# EAGLE board ZORRO-LAN-IDE-CP-V2E (EAGLE 6.5.0), part 1 of 2
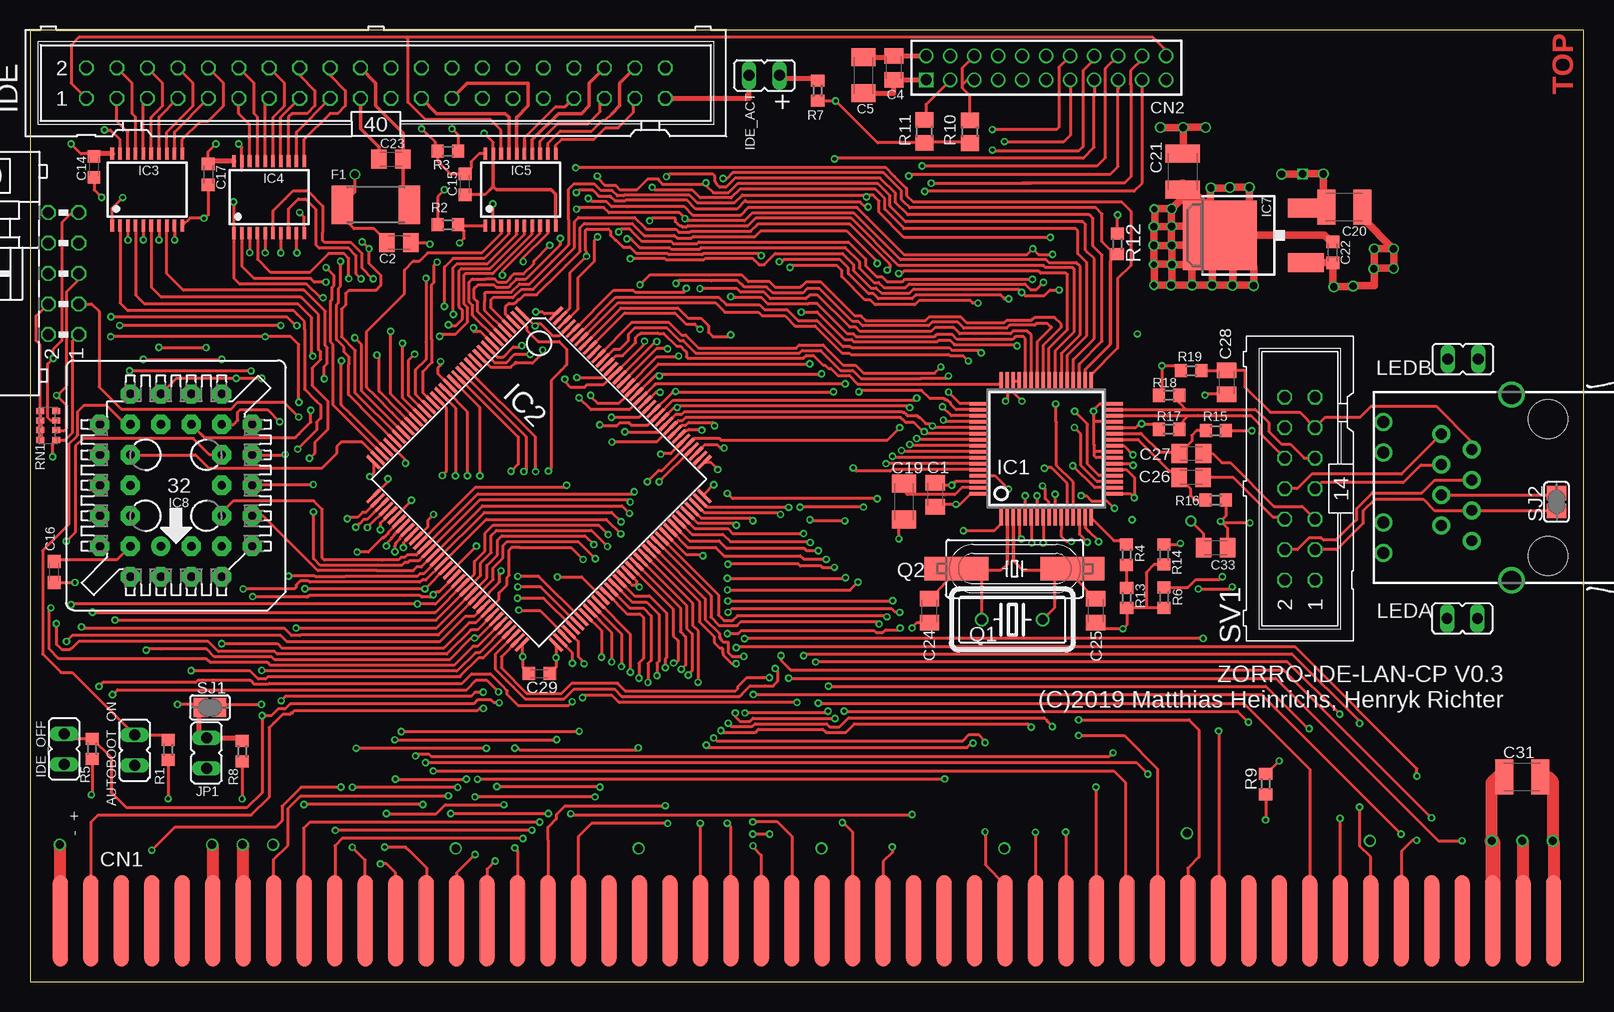
[diagram p3: board, top side]
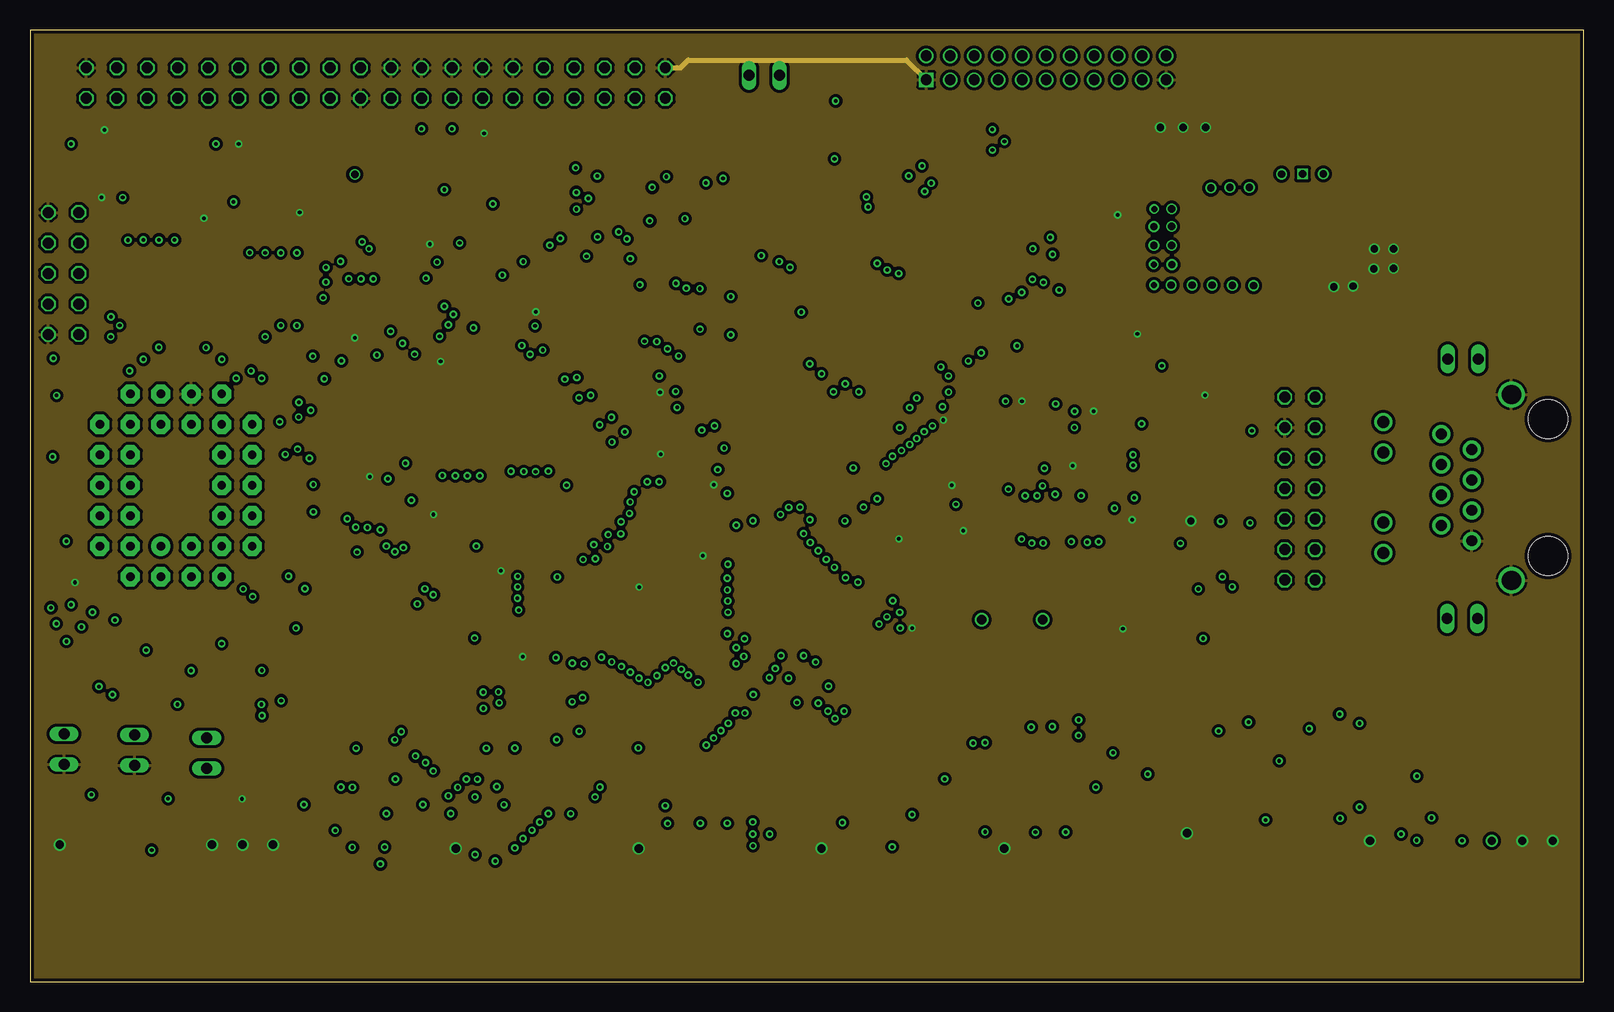
[diagram p4: board, inner layer Route2-GND]
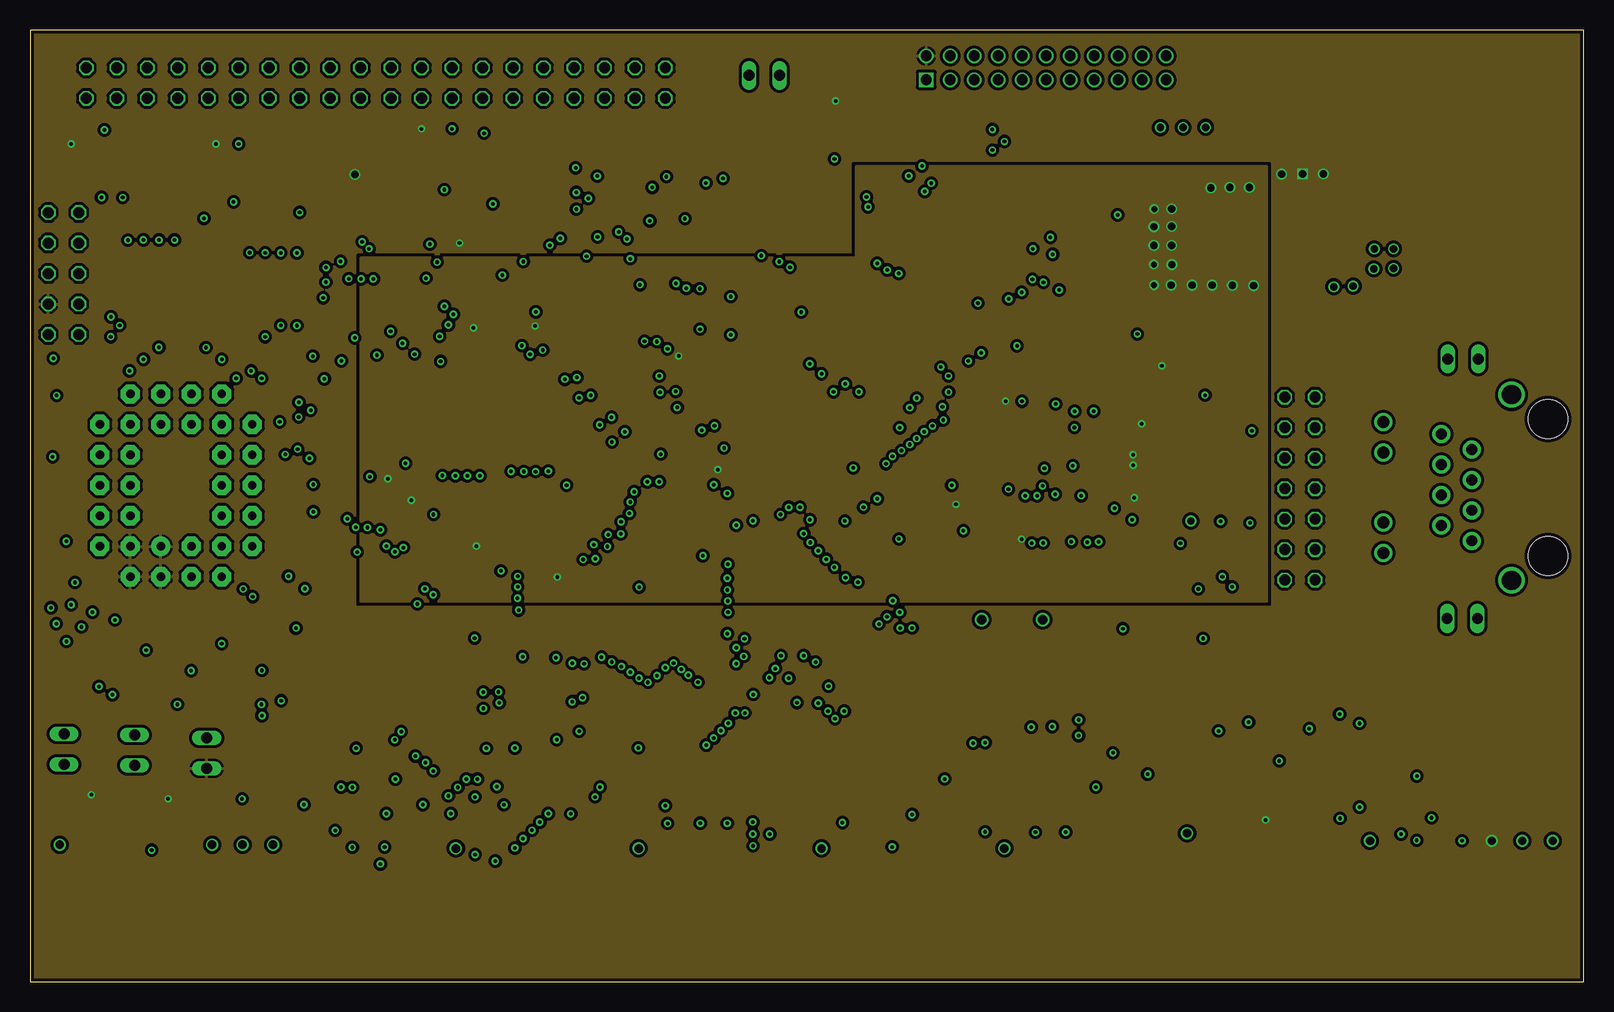
[diagram p5: board, inner layer Route15-VCC]
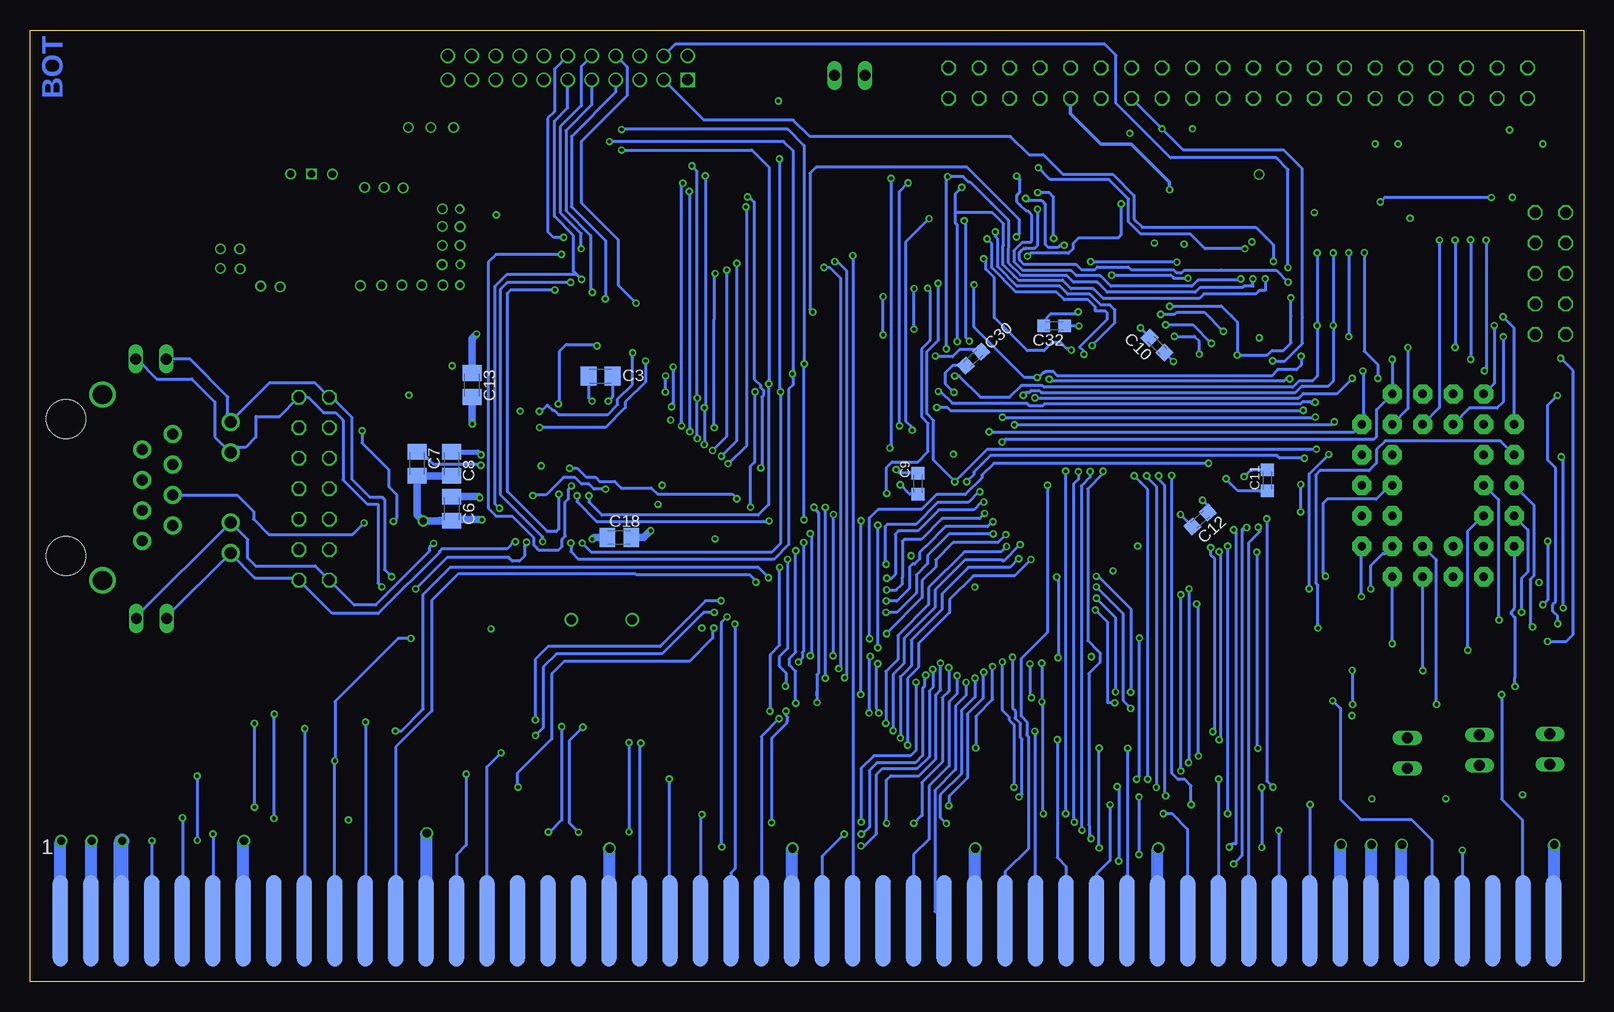
[diagram p6: board, bottom side, seen from below]

Size 129.54 x 79.36 mm. Coordinates in mm from the lower left corner, seen from the top.
Outline: 129.54,0 129.54,79.36 0,79.36 0,0 129.54,0
Copper layers (1+2*15+16): Top 0.035mm / dielectric 0.36mm / Route2-GND 0.035mm / dielectric 0.71mm / Route15-VCC 0.035mm / dielectric 0.36mm / Bottom 0.035mm
Design rules "LeitOn - Standard-Eagle-DRU - 4-Lagen Multilayer - deutsch - Rev 2.0 *": minimum track width 0.15mm, minimum drill 0.3mm, track to track 0.15mm, track to pad 0.15mm, pad to pad 0.15mm, via to via 0.15mm, smd to smd 0.15mm, copper to edge 0.3mm, drill to drill 0.3mm, minimum pad ring 0.15mm, minimum via ring 0.15mm, stop-mask expansion 0.075mm, vias tented up to drill 0.4mm, thermal gap 0.2mm
Net classes: 0 default: width 0.152 mm, drill 0.3 mm; 1 Power: width 0.305 mm, drill 0.3 mm, clearance 0.102 mm

## Footprints (pad centres in the part's own frame; a part is rotated, then mirrored left to right if it is on the bottom)
JP1 = drill 0.914 long: 1 0,-1.27; 2 0,1.27
C0805K = smd 1.3 x 1.6: 1 -1,0; 2 1,0
C1206K = smd 1.5 x 2: 1 -1.5,0; 2 1.5,0
C0603K = smd 1.05 x 1.08: 1 -0.875,0; 2 0.875,0
C1210K = smd 1.5 x 2.9: 1 -1.5,0; 2 1.5,0
LKONT_50_R = smd 1.27 x 7.62 bottom: 1 64.77,0; 3 62.23,0; 5 59.69,0; 7 57.15,0; 9 54.61,0; 11 52.07,0; 13 49.53,0; 15 46.99,0; 17 44.45,0; 19 41.91,0; 21 39.37,0; 23 36.83,0; 25 34.29,0; 27 31.75,0; 29 29.21,0; 31 26.67,0; 33 24.13,0; 35 21.59,0; 37 19.05,0; 39 16.51,0; 41 13.97,0; 43 11.43,0; 45 8.89,0; 47 6.35,0; 49 3.81,0; 51 1.27,0; 53 -1.27,0; 55 -3.81,0; 57 -6.35,0; 59 -8.89,0; 61 -11.43,0; 63 -13.97,0; 65 -16.51,0; 67 -19.05,0; 69 -21.59,0; 71 -24.13,0; 73 -26.67,0; 75 -29.21,0; 77 -31.75,0; 79 -34.29,0; 81 -36.83,0; 83 -39.37,0; 85 -41.91,0; 87 -44.45,0; 89 -46.99,0; 91 -49.53,0; 93 -52.07,0; 95 -54.61,0; 97 -57.15,0; 99 -59.69,0 | smd 1.27 x 7.62: 2 64.77,0; 4 62.23,0; 6 59.69,0; 8 57.15,0; 10 54.61,0; 12 52.07,0; 14 49.53,0; 16 46.99,0; 18 44.45,0; 20 41.91,0; 22 39.37,0; 24 36.83,0; 26 34.29,0; 28 31.75,0; 30 29.21,0; 32 26.67,0; 34 24.13,0; 36 21.59,0; 38 19.05,0; 40 16.51,0; 42 13.97,0; 44 11.43,0; 46 8.89,0; 48 6.35,0; 50 3.81,0; 52 1.27,0; 54 -1.27,0; 56 -3.81,0; 58 -6.35,0; 60 -8.89,0; 62 -11.43,0; 64 -13.97,0; 66 -16.51,0; 68 -19.05,0; 70 -21.59,0; 72 -24.13,0; 74 -26.67,0; 76 -29.21,0; 78 -31.75,0; 80 -34.29,0; 82 -36.83,0; 84 -39.37,0; 86 -41.91,0; 88 -44.45,0; 90 -46.99,0; 92 -49.53,0; 94 -52.07,0; 96 -54.61,0; 98 -57.15,0; 100 -59.69,0
CP-2X11-2.00 = drill 0.914 square: 19 -10,-1 | drill 0.914: 20 -10,1; 21 -8,-1; 22 -8,1; 23 -6,-1; 24 -6,1; 25 -4,-1; 26 -4,1; 27 -2,-1; 28 -2,1; 29 0,-1; 30 0,1; 31 2,-1; 32 2,1; 33 4,-1; 34 4,1; 35 6,-1; 36 6,1; 37 8,-1; 38 8,1; 39 10,-1; 40 10,1
R2512 = smd 1.8 x 3.2: 1 -2.8,0; 2 2.8,0
SQFP-S-10X10-64 = smd 0.3 x 1.6: 1 -3.75,-5.6; 2 -3.25,-5.6; 3 -2.75,-5.6; 4 -2.25,-5.6; 5 -1.75,-5.6; 6 -1.25,-5.6; 7 -0.75,-5.6; 8 -0.25,-5.6; 9 0.25,-5.6; 10 0.75,-5.6; 11 1.25,-5.6; 12 1.75,-5.6; 13 2.25,-5.6; 14 2.75,-5.6; 15 3.25,-5.6; 16 3.75,-5.6; 33 3.75,5.6; 34 3.25,5.6; 35 2.75,5.6; 36 2.25,5.6; 37 1.75,5.6; 38 1.25,5.6; 39 0.75,5.6; 40 0.25,5.6; 41 -0.25,5.6; 42 -0.75,5.6; 43 -1.25,5.6; 44 -1.75,5.6; 45 -2.25,5.6; 46 -2.75,5.6; 47 -3.25,5.6; 48 -3.75,5.6 | smd 1.6 x 0.3: 17 5.6,-3.75; 18 5.6,-3.25; 19 5.6,-2.75; 20 5.6,-2.25; 21 5.6,-1.75; 22 5.6,-1.25; 23 5.6,-0.75; 24 5.6,-0.25; 25 5.6,0.25; 26 5.6,0.75; 27 5.6,1.25; 28 5.6,1.75; 29 5.6,2.25; 30 5.6,2.75; 31 5.6,3.25; 32 5.6,3.75; 49 -5.6,3.75; 50 -5.6,3.25; 51 -5.6,2.75; 52 -5.6,2.25; 53 -5.6,1.75; 54 -5.6,1.25; 55 -5.6,0.75; 56 -5.6,0.25; 57 -5.6,-0.25; 58 -5.6,-0.75; 59 -5.6,-1.25; 60 -5.6,-1.75; 61 -5.6,-2.25; 62 -5.6,-2.75; 63 -5.6,-3.25; 64 -5.6,-3.75
TQFP144 = smd 0.27 x 1.5: 1 -8.75,-10.75; 2 -8.25,-10.75; 3 -7.75,-10.75; 4 -7.25,-10.75; 5 -6.75,-10.75; 6 -6.25,-10.75; 7 -5.75,-10.75; 8 -5.25,-10.75; 9 -4.75,-10.75; 10 -4.25,-10.75; 11 -3.75,-10.75; 12 -3.25,-10.75; 13 -2.75,-10.75; 14 -2.25,-10.75; 15 -1.75,-10.75; 16 -1.25,-10.75; 17 -0.75,-10.75; 18 -0.25,-10.75; 19 0.25,-10.75; 20 0.75,-10.75; 21 1.25,-10.75; 22 1.75,-10.75; 23 2.25,-10.75; 24 2.75,-10.75; 25 3.25,-10.75; 26 3.75,-10.75; 27 4.25,-10.75; 28 4.75,-10.75; 29 5.25,-10.75; 30 5.75,-10.75; 31 6.25,-10.75; 32 6.75,-10.75; 33 7.25,-10.75; 34 7.75,-10.75; 35 8.25,-10.75; 36 8.75,-10.75; 73 8.75,10.75; 74 8.25,10.75; 75 7.75,10.75; 76 7.25,10.75; 77 6.75,10.75; 78 6.25,10.75; 79 5.75,10.75; 80 5.25,10.75; 81 4.75,10.75; 82 4.25,10.75; 83 3.75,10.75; 84 3.25,10.75; 85 2.75,10.75; 86 2.25,10.75; 87 1.75,10.75; 88 1.25,10.75; 89 0.75,10.75; 90 0.25,10.75; 91 -0.25,10.75; 92 -0.75,10.75; 93 -1.25,10.75; 94 -1.75,10.75; 95 -2.25,10.75; 96 -2.75,10.75; 97 -3.25,10.75; 98 -3.75,10.75; 99 -4.25,10.75; 100 -4.75,10.75; 101 -5.25,10.75; 102 -5.75,10.75; 103 -6.25,10.75; 104 -6.75,10.75; 105 -7.25,10.75; 106 -7.75,10.75; 107 -8.25,10.75; 108 -8.75,10.75 | smd 1.5 x 0.27: 37 10.75,-8.75; 38 10.75,-8.25; 39 10.75,-7.75; 40 10.75,-7.25; 41 10.75,-6.75; 42 10.75,-6.25; 43 10.75,-5.75; 44 10.75,-5.25; 45 10.75,-4.75; 46 10.75,-4.25; 47 10.75,-3.75; 48 10.75,-3.25; 49 10.75,-2.75; 50 10.75,-2.25; 51 10.75,-1.75; 52 10.75,-1.25; 53 10.75,-0.75; 54 10.75,-0.25; 55 10.75,0.25; 56 10.75,0.75; 57 10.75,1.25; 58 10.75,1.75; 59 10.75,2.25; 60 10.75,2.75; 61 10.75,3.25; 62 10.75,3.75; 63 10.75,4.25; 64 10.75,4.75; 65 10.75,5.25; 66 10.75,5.75; 67 10.75,6.25; 68 10.75,6.75; 69 10.75,7.25; 70 10.75,7.75; 71 10.75,8.25; 72 10.75,8.75; 109 -10.75,8.75; 110 -10.75,8.25; 111 -10.75,7.75; 112 -10.75,7.25; 113 -10.75,6.75; 114 -10.75,6.25; 115 -10.75,5.75; 116 -10.75,5.25; 117 -10.75,4.75; 118 -10.75,4.25; 119 -10.75,3.75; 120 -10.75,3.25; 121 -10.75,2.75; 122 -10.75,2.25; 123 -10.75,1.75; 124 -10.75,1.25; 125 -10.75,0.75; 126 -10.75,0.25; 127 -10.75,-0.25; 128 -10.75,-0.75; 129 -10.75,-1.25; 130 -10.75,-1.75; 131 -10.75,-2.25; 132 -10.75,-2.75; 133 -10.75,-3.25; 134 -10.75,-3.75; 135 -10.75,-4.25; 136 -10.75,-4.75; 137 -10.75,-5.25; 138 -10.75,-5.75; 139 -10.75,-6.25; 140 -10.75,-6.75; 141 -10.75,-7.25; 142 -10.75,-7.75; 143 -10.75,-8.25; 144 -10.75,-8.75
TSSOP20 = smd 0.3 x 1: 1 -2.925,-3; 2 -2.275,-3; 3 -1.625,-3; 4 -0.975,-3; 5 -0.325,-3; 6 0.325,-3; 7 0.975,-3; 8 1.625,-3; 9 2.275,-3; 10 2.925,-3; 11 2.925,3; 12 2.275,3; 13 1.625,3; 14 0.975,3; 15 0.325,3; 16 -0.325,3; 17 -0.975,3; 18 -1.625,3; 19 -2.275,3; 20 -2.925,3
DPACK = smd 1.6 x 3: 1 -2.28,-4.8; 3 2.28,-4.8 | smd 5.8 x 6.2: 4 0,2.38
PLCC-SR32 = drill 0.7 pad 1.6: 1 1.27,5.08 | drill 0.7 pad 1.6 octagon: 2 -1.27,7.62; 3 -1.27,5.08; 4 -3.81,7.62; 5 -6.35,5.08; 6 -3.81,5.08; 7 -6.35,2.54; 8 -3.81,2.54; 9 -6.35,0; 10 -3.81,0; 11 -6.35,-2.54; 12 -3.81,-2.54; 13 -6.35,-5.08; 14 -3.81,-7.62; 15 -3.81,-5.08; 16 -1.27,-7.62; 17 -1.27,-5.08; 18 1.27,-7.62; 19 1.27,-5.08; 20 3.81,-7.62; 21 6.35,-5.08; 22 3.81,-5.08; 23 6.35,-2.54; 24 3.81,-2.54; 25 6.35,0; 26 3.81,0; 27 6.35,2.54; 28 3.81,2.54; 29 6.35,5.08; 30 3.81,7.62; 31 3.81,5.08; 32 1.27,7.62
ML40 = drill 0.914 octagon: 1 -24.13,-1.27; 2 -24.13,1.27; 3 -21.59,-1.27; 4 -21.59,1.27; 5 -19.05,-1.27; 6 -19.05,1.27; 7 -16.51,-1.27; 8 -16.51,1.27; 9 -13.97,-1.27; 10 -13.97,1.27; 11 -11.43,-1.27; 12 -11.43,1.27; 13 -8.89,-1.27; 14 -8.89,1.27; 15 -6.35,-1.27; 16 -6.35,1.27; 17 -3.81,-1.27; 18 -3.81,1.27; 19 -1.27,-1.27; 20 -1.27,1.27; 21 1.27,-1.27; 22 1.27,1.27; 23 3.81,-1.27; 24 3.81,1.27; 25 6.35,-1.27; 26 6.35,1.27; 27 8.89,-1.27; 28 8.89,1.27; 29 11.43,-1.27; 30 11.43,1.27; 31 13.97,-1.27; 32 13.97,1.27; 33 16.51,-1.27; 34 16.51,1.27; 35 19.05,-1.27; 36 19.05,1.27; 37 21.59,-1.27; 38 21.59,1.27; 39 24.13,-1.27; 40 24.13,1.27
HC18U-V = drill 0.813: 1 -2.54,0; 2 2.54,0
HC49UP = smd 5.334 x 1.93: 1 -4.826,0; 2 4.826,0
R0603 = smd 1 x 1.1: 1 -0.85,0; 2 0.85,0
R0805 = smd 1.3 x 1.5: 1 -0.95,0; 2 0.95,0
CAY16 = smd 0.5 x 0.65: 1 -1.2,-0.675; 2 -0.4,-0.675; 3 0.4,-0.675; 4 1.2,-0.675; 5 1.2,0.675; 6 0.4,0.675; 7 -0.4,0.675; 8 -1.2,0.675
SJ = smd 1.168 x 1.6: 1 -0.762,0; 2 0.762,0
ML14 = drill 0.914 octagon: 1 -7.62,-1.27; 2 -7.62,1.27; 3 -5.08,-1.27; 4 -5.08,1.27; 5 -2.54,-1.27; 6 -2.54,1.27; 7 0,-1.27; 8 0,1.27; 9 2.54,-1.27; 10 2.54,1.27; 11 5.08,-1.27; 12 5.08,1.27; 13 7.62,-1.27; 14 7.62,1.27
ML10L = drill 0.914 octagon: 1 -5.08,-1.27; 2 -5.08,1.27; 3 -2.54,-1.27; 4 -2.54,1.27; 5 0,-1.27; 6 0,1.27; 7 2.54,-1.27; 8 2.54,1.27; 9 5.08,-1.27; 10 5.08,1.27
SI-50170 = drill 0.9 pad 1.5: 1 4.445,5.842; 2 3.175,3.302; 3 1.905,5.842; 4 0.635,3.302; 5 -0.635,5.842; 6 -1.905,3.302; 7 -3.175,5.842; 8 -4.445,3.302 | drill 1.016 pad 1.5: A1 -5.461,10.668; A2 2.921,10.668; C1 -2.921,10.668; C2 5.461,10.668 | drill 1.6 pad 2.2: S1 -7.747,0; S2 7.747,0 | hole 3.251: -5.715,-3.048; 5.715,-3.048

## Placement (x,y rotation side)
AUTOBOOT_ON  [JP1]  8.72,19.31 0 top
C1  100nF  [C0805K]  75.47,40.62 270 top
C2  10u  [C0805K]  30.77,61.62 0 top
C3  100nF  [C0805K]  81.98,50.49 0 bottom
C4  100nF  [C0805K]  72.01,76.2 90 top
C5  47uF  [C1206K]  69.47,75.56 270 top
C6  100nF  [C0805K]  94.39,39.44 90 bottom
C7  100nF  [C0805K]  97.27,43.2 90 bottom
C8  100nF  [C0805K]  94.39,43.19 90 bottom
C9  100n  [C0603K]  55.52,41.53 90 bottom
C10  100n  [C0603K]  35.59,53.07 134.9 bottom
C11  100n  [C0603K]  26.39,41.81 90 bottom
C12  100n  [C0603K]  32,38.54 222.1 bottom
C13  100nF  [C0805K]  92.69,49.75 270 bottom
C14  100n  [C0603K]  5.33,67.94 270 top
C15  100n  [C0603K]  36.26,66.48 270 top
C16  100n  [C0603K]  2.01,34.17 270 top
C17  100n  [C0603K]  14.86,67.31 270 top
C18  100nF  [C0805K]  80.41,37.04 180 bottom
C19  10u  [C1206K]  72.84,40.03 270 top
C20  10u  [C1210K]  109.55,64.58 0 top
C21  10u  [C1210K]  96.08,67.55 90 top
C22  100n  [C0603K]  108.59,60.82 270 top
C23  10u  [C0805K]  30.1,68.58 180 top
C24  27p  [C0805K]  74.97,30.92 270 top
C25  27p  [C0805K]  88.83,30.93 270 top
C26  6.8n  [C0805K]  96.79,42.05 0 top
C27  6.8n  [C0805K]  96.81,44.04 0 top
C28  10n  [C0805K]  99.75,49.99 90 top
C29  100n  [C0603K]  42.45,25.7 180 top
C30  100n  [C0603K]  50.9,51.96 42.4 bottom
C31  47u  [C1210K]  124.38,17.08 0 top
C32  100n  [C0603K]  44.16,54.69 180 bottom
C33  10n  [C0805K]  98.84,36.2 180 top
CN1  ZORROII_EDGE_ROUND_CONTACTS  [LKONT_50_R]  62.23,5.08 0 top
CN2  A1200-CLOCKPORT  [CP-2X11-2.00]  84.71,76.2 0 top
F1  500mA  [R2512]  28.83,64.77 180 top
IC1  ENC624J600  [SQFP-S-10X10-64]  84.71,44.45 0 top
IC2  XC95288XL-TQ144  [TQFP144]  42.43,41.91 225 top
IC3  74HCT245PW  [TSSOP20]  9.78,66.04 0 top
IC4  74HCT245PW  [TSSOP20]  19.94,65.41 0 top
IC5  74HCT245PW  [TSSOP20]  40.89,66.04 0 top
IC7  LD117ADT33TR  [DPACK]  101.57,62.23 90 top
IC8  AM29F010S  [PLCC-SR32]  12.17,41.39 180 top
IDE  [ML40]  28.83,74.93 0 top
IDE_ACT  [JP1]  61.21,75.56 90 top
IDE_OFF  [JP1]  2.84,19.41 0 top
JP1  [JP1]  14.73,19.08 180 top
LEDA  [JP1]  119.4,30.29 270 top
LEDB  [JP1]  119.44,51.93 90 top
Q1  25MHz  [HC18U-V]  81.88,30.19 180 top
Q2  25MHz  [HC49UP]  82.07,34.43 180 top
R1  4.7k  [R0603]  11.52,19.33 90 top
R2  4.7k  [R0603]  34.85,63.12 180 top
R3  4.7k  [R0603]  34.83,69.25 0 top
R4  390  [R0603]  91.4,35.6 270 top
R5  4.7k  [R0603]  5.18,19.42 90 top
R6  180  [R0603]  94.53,32.03 270 top
R7  330  [R0603]  65.66,74.3 90 top
R8  4.7k  [R0603]  17.69,19.22 270 top
R9  4.7k  [R0603]  103,16.47 90 top
R10  1K  [R0805]  78.36,70.87 90 top
R11  1K  [R0805]  74.57,70.89 90 top
R12  3.3k  [R0603]  90.65,61.52 270 top
R13  12k  [R0603]  91.42,32 270 top
R14  180  [R0603]  94.52,35.63 270 top
R15  49.9  [R0603]  98.86,45.96 180 top
R16  49.9  [R0603]  98.85,40.16 180 top
R17  49.9  [R0603]  94.94,46.06 180 top
R18  49.9  [R0603]  94.96,48.9 180 top
R19  10  [R0603]  96.79,50.95 180 top
RN1  [CAY16]  1.52,46.38 90 top
SJ1  [SJ]  15,22.87 180 top
SJ2  [SJ]  127.25,40.01 90 top
SV1  [ML14]  105.85,41.12 90 top
SV2  [ML10L]  2.79,59.05 90 top
X1  SI-50170  [SI-50170]  123.49,41.21 90 top

## Tracks (layer width: path | path; a pad name or v marks a point on that pad's centre or on a via)
!AS  (via drill 0.3)
  Top 0.254: v37.11,10.61 35.56,9.07 CN1.74 | v47.1,15.41 v37.09,15.41 | IC2.80 | IC2.80 47.64,29.27 v47.64,27.06 | v47.64,27.06
  Bottom 0.254: v37.09,15.41 37.11,15.4 v37.11,10.61 | v47.64,27.06 47.64,22.8 47.41,22.58 47.41,22.05 47.4,22.04 47.4,21.95 46.94,21.5 46.96,21.48 46.96,20.35 46.85,20.24 46.85,15.67 v47.1,15.41 46.94,15.57
!BERR  (via drill 0.3)
  Top 0.254: IC2.98 57.38,32.26 57.38,30.57 57.84,30.11 58.57,30.11 58.97,30.51 71.36,30.51 v71.44,30.43 | 71.09,5.12 CN1.46 71.12,10.02 71.88,10.78 v71.88,11.25
  Bottom 0.254: v71.88,11.25 71.88,29.99 v71.44,30.43
!CFIN  (via drill 0.3)
  Top 0.254: IC2.104 | IC2.104 55.65,38.23 58.73,38.23 58.73,38.22 v58.88,38.06 | v115.6,11.8 115.25,11.8 114.32,10.86 114.32,5.09 CN1.12 | v58.88,27.85 58.97,27.94 105.43,27.94 115.61,17.76 v115.61,17.14
  Bottom 0.254: v58.88,38.06 v58.88,27.85 | v115.61,17.14 v115.61,11.81 v115.6,11.8
!CFOUT  (via drill 0.3)
  Top 0.254: IC2.105 55.2,39.44 55.94,38.69 60.02,38.69 v60.26,38.44 | v60.29,23.95 102.63,23.95 114.3,12.29 v114.29,12.3
  Bottom 0.254: 60.25,38.43 v60.26,38.44 60.29,38.42 v60.29,23.95 | CN1.11 | CN1.11 | v114.29,12.3 114.29,5.09 CN1.11
!DS0  (via drill 0.3)
  Top 0.254: IC2.93 54.74,31.37 54.74,29.48 55.2,29.01 55.2,25.93 54.88,25.6 v54.88,25.57 | v60.25,12.32 v61.66,12.32
  Bottom 0.254: v54.88,25.57 54.98,25.46 54.98,24.63 55.14,24.48 55.14,18.86 55.74,18.25 58.94,18.25 59.57,17.62 59.57,12.88 60.14,12.32 v60.25,12.32 | v61.66,12.32 63.5,10.48 CN1.51
!DS1  (via drill 0.3)
  Top 0.254: CN1.98 5.1,5.1 5.1,13.32 5.68,13.91 18.45,13.91 19.92,15.38 19.92,21.18 20.3,21.55 20.32,21.55 21.05,22.29 21.67,22.29 21.83,22.44 21.86,22.41 22.04,22.59 37.29,22.59 37.49,22.79 v37.78,22.79 | IC2.78 42.57,32.93 v40.65,32.93
  Bottom 0.254: v40.65,32.93 38.44,30.71 38.44,23.44 v37.78,22.79
!DTACK  (via drill 0.3)
  Top 0.254: IC2.85 49.76,30.68 50.84,30.68 51.16,30.36 51.16,26.98 50.77,26.58 v50.77,25.31 | v53.15,13.2 46.81,13.2 45.71,12.09 45.71,5.09 CN1.66
  Bottom 0.254: v50.77,25.31 50.77,23.75 51.9,22.61 51.9,17.34 53.67,15.56 53.67,13.68 53.63,13.68 v53.15,13.2
!FCS  (via drill 0.3)
  Top 0.254: IC2.77 42.82,31.97 v40.64,31.97 | 7.08,24.14 v6.88,23.94 7.29,24.35 36.4,24.35 37.16,25.11 38.1,25.11 v39.05,24.16
  Bottom 0.254: CN1.97 5.11,5.11 5.11,13.48 6.86,15.23 6.86,23.92 v6.88,23.94 | v40.64,31.97 40.64,31.95 39.05,30.36 v39.05,24.16
!IDE_ACT
  Top 0.406: IDE.39 59.94,73.66 IDE_ACT.2
!IDE_R
  Top 0.305: IC5.16 40.57,72.08 40.58,72.08 41.53,73.03 41.53,74.93 36.45,74.93 IDE.25
!IDE_W
  Top 0.305: IC5.17 39.92,72.09 39.62,72.39 33.91,72.39 IDE.23
!LDS  (via drill 0.3)
  Top 0.254: v40.42,11.16 40.64,10.94 CN1.70 | IC2.82 49.3,29.02 v49.3,26.28 | v40.41,19.47 40.69,19.47 40.82,19.35 50.56,19.35 v50.71,19.5
  Bottom 0.254: v49.3,26.28 49.3,23.53 50.71,22.12 v50.71,19.5 | v40.42,11.16 40.42,19.46 v40.41,19.47
!MTACK  (via drill 0.3)
  Top 0.254: IC2.96 51.97,36.23 56.28,31.93 56.28,30.21 57.46,29.03 57.46,28.79 57.51,28.75 57.51,28.65 57.61,28.55 57.61,28.5 57.79,28.32 58.18,28.32 58.2,28.3 58.2,27.47 58.54,27.13 v59.5,27.13 | 59.7,22.51 v59.6,22.41 66.37,22.41 v66.52,22.56 | 68.58,8.28 CN1.48 68.57,12.48 67.78,13.28 v67.72,13.28
  Bottom 0.254: v59.5,27.13 59.6,27.04 v59.6,22.41 | v66.52,22.56 66.52,22.21 66.38,22.07 66.38,21.74 66.44,21.67 66.44,21.57 67.72,20.29 v67.72,13.28
!MTCR  (via drill 0.3)
  Top 0.254: IC2.101 53.74,38.01 54.98,36.76 57.44,36.76 58.08,36.13 64.55,36.13 64.75,35.93 65.56,35.93 65.58,35.95 v65.71,35.95 | CN1.18 106.68,17.72 101.17,23.23 v65.71,23.23
  Bottom 0.254: v65.71,23.23 65.71,25.88 66.23,26.4 66.23,26.95 65.71,27.47 v65.71,35.94 v65.71,35.95
!OVR  (via drill 0.3)
  Top 0.254: IC2.100 53.39,37.66 54.81,36.23 57.16,36.23 57.87,35.52 64.2,35.52 64.49,35.24 66.36,35.24 v66.38,35.22 | v106.64,21.11 106.54,21.11 103.01,24.64 v66.57,24.64
  Bottom 0.254: v66.38,35.22 66.38,27.78 67.09,27.07 67.09,26.33 66.5,25.74 66.5,24.75 66.57,24.69 v66.57,24.64 | v106.64,21.11 106.64,5.12 CN1.17
!OWN  (via drill 0.3)
  Top 0.254: IC2.107 56.33,39.68 56.33,39.66 56.44,39.55 v63.25,39.55 | v63.24,25.31 103.85,25.31 117.41,11.75 119.37,11.75 v119.38,11.76
  Bottom 0.254: 119.36,5.1 CN1.7 | v63.24,25.31 v63.24,39.55 v63.25,39.55 | v119.38,11.76 CN1.7 | CN1.7
!RESET  (via drill 0.3)
  Top 0.254: IC2.143 44.23,55.34 44.23,55.39 45,56.17 45,59.11 46.38,60.5 v46.4,60.5 46.4,60.88 46.31,60.97 46.31,62.66 46.42,62.77 48.22,62.77 48.39,62.6 48.39,62.25 48.81,61.83 48.86,61.83 49.35,61.34 49.37,61.34 49.44,61.27 50,61.27 50.54,60.73 53.13,60.73 53.24,60.61 56.03,60.61 56.14,60.73 60.77,60.73 v60.96,60.54 | IC5.2 38.62,64.82 v38.59,64.85
  Bottom 0.254: v38.59,64.85 38.59,62.26 38.83,62.02 42.13,62.02 42.6,61.55 42.6,61.09 42.96,60.73 46.16,60.73 v46.4,60.5 | v60.96,60.54 CN1.53
!SLAVE  (via drill 0.3)
  Top 0.254: IC2.106 55.54,39.79 56.21,39.12 62.45,39.12 62.45,39.07 v62.56,38.96 | v62.61,27.18 v62.62,27.17 62.62,26.79 63.4,26 104.49,26 v116.83,13.66
  Bottom 0.254: v62.61,27.18 62.58,27.21 62.58,38.95 v62.56,38.96 | CN1.9 116.83,5.09 v116.83,13.66
!UDS  (via drill 0.3)
  Top 0.254: 38.05,5.13 CN1.72 38.1,9.39 v38.78,10.07 | IC2.81 47.47,30.15 47.47,30.13 48.49,29.11 v48.49,26.67 v48.49,26.66 | v47.52,16.23 47.47,16.27 v38.91,16.27
  Bottom 0.254: v47.52,16.23 47.52,21.44 47.92,21.84 47.92,22.07 48.49,22.64 v48.49,26.66 | v38.91,16.27 38.78,16.14 v38.78,10.07
+3V3  (via drill 0.3, 0.5, 0.6)
  Top 0.254: IC1.28 92.17,46.2 92.49,46.52 v92.67,46.52 93.63,46.52 R17.2 | IC1.25 91.18,44.7 v91.95,43.93 | IC1.22 91.83,43.2 v91.96,43.07 91.97,43.08 | IC1.21 91.41,42.7 92.05,42.06 v92.05,40.36 91.71,40.7 IC1.17 | IC1.64 79.08,40.67 78.38,40.67 77.51,39.8 v77.19,39.8 75.65,39.8 C1.2 | IC1.4 82.46,37.11 v82.66,36.91 | 28.67,40.5 IC2.37 29.84,41.7 v29.84,41.93 | IC2.1 41.01,55.67 41.11,55.67 v42.1,54.68 | IC2.8 38.54,53.24 37.57,54.2 37.28,54.2 | v42.1,54.68 42.1,54.63 | 37.28,54.2 v36.97,54.52 | 37.28,54.2 37,54.2 | IC2.141 44.9,54.63 44.13,53.85 43.58,53.85 43.53,53.91 | 43.53,53.91 | 43.53,53.91 42.6,54.84 42.26,54.84 v42.1,54.68 | IC2.127 52.27,52.11 54.01,52.11 v54.07,52.17 | IC2.109 56.72,43.32 v57.34,42.7 | IC1.47 81.46,48.55 v81.32,48.41 | IC2.55 35.01,34.13 v37.21,36.33 | IC2.42 30.41,38.75 v31.8,40.14 | IC2.73 v43.84,27.02 | v43.84,27.02 v43.85,27.02 | 47.73,32.03 IC2.84 45.99,33.75 v43.95,33.75 | v43.84,27.02 43.84,26.22 C29.1 | C21.1 96.08,65.96 | 95.19,59.78 v95.19,59.8 | 96.87,58.12 v96.87,58.09 | v98.54,58.09 98.57,58.09 98.57,59.75 | 98.46,66.18 98.46,64.72 97.93,64.19 | R18.2 94.35,49.14 v94.35,51.36 95.53,51.36 R19.2
  Top 0.61: 99.73,61.69 99.55,61.87 | 99.55,61.87 IC7.4 | 95.14,58.1 98.55,58.1 98.57,58.09 100.25,58.09 100.27,58.07 | 100.27,58.07 102,58.07 102.01,58.05 102.01,59.58 101.95,59.64 | 100.27,58.07 100.27,59.71 | 93.68,62.98 v95.17,62.98 95.19,62.99 96.43,62.99 96.44,63.01 | 96.08,65.96 96.08,65.34 95.19,64.45 93.77,64.45 93.76,64.44 93.76,63.04 93.69,62.98 93.69,61.39 | 93.69,61.39 93.69,59.83 93.68,59.82 95.16,59.82 95.17,59.8 | 95.17,59.8 95.17,61.36 95.16,61.37 95.16,62.99 95.14,63.01 95.14,64.45 95.16,64.47 | 95.17,59.8 95.17,58.07 93.76,58.07 93.73,58.1 93.73,59.78 | 93.69,61.39 v95.17,61.39 95.19,61.4 96.36,61.4 96.38,61.42 | 95.19,59.78 96.73,59.78 96.74,59.8 | 96.87,58.12 96.87,59.83 96.84,59.87 | 98.57,58.1 98.57,59.75 98.6,59.78 | C22.1 108.44,61.69 107.89,62.25 99.92,62.25 99.55,61.87 | 98.41,64.98 98.41,66.14 98.46,66.18 100,66.18 100.04,66.23 101.66,66.23 101.66,64.93 101.65,64.91
  Top 1.676: IC7.4 99.19,62.94 97.93,64.19 C21.1
  Bottom 0.254: C3.2 80.98,48.76 v81.32,48.41 | C9.2 57.04,42.4 v57.34,42.7 | C12.1 31.35,39.69 v31.8,40.14 | v43.85,27.02 43.8,27.07 43.8,33.6 v43.95,33.75 | 92.67,48.73 C13.2 | C7.2 96.95,44.2 95.92,43.17 92.06,43.17 v91.96,43.07 | v54.07,52.17 54.01,52.11 52.64,52.11 52.04,52.7 50.45,52.7 50.3,52.55 C30.2 | C32.1 42.11,54.69 v42.1,54.68 | C11.1 28.84,40.94 v29.84,41.93 | C10.2 36.21,53.76 v36.97,54.52
  Bottom 0.406: C8.2 92.2,44.19 v91.95,43.93
  Bottom 0.61: 92.67,48.73 v92.67,46.52 | C6.2 92.13,40.44 v92.05,40.36 | C18.2 82.53,37.04 v82.66,36.91
  other vias: 93.71,64.44 93.69,58.09 93.68,62.96 93.68,61.4 93.68,59.8 95.17,64.44 95.12,58.09 100.23,58.07 102,58.04 98.44,66.18 100.03,66.23 101.65,66.23
  pour Route15-VCC (isolate 0.254): 27.56,31.75 103.12,31.75 103.12,67.94 68.83,67.94 68.83,60.33 27.56,60.33
+5V  (via drill 0.3, 0.3 pad 0.3, 0.6, 0.7)
  Top 0.254: IC3.20 4.24,69.04 v3.43,69.85 | C17.1 14.86,69.22 v15.49,69.85 | v35.81,61.59 36.21,61.99 36.21,62.61 R2.1 35.83,62.99 37.92,62.99 | R7.1 v67.16,73.44 | v67.16,73.44 | IC8.31 7.22,35.17 2.14,35.17 C16.1 | R10.1 78.33,69.92 78.25,70.01 74.63,70.01 R11.1 70.66,69.94 v67.16,73.44 | R5.1 5.18,15.65 v5.12,15.6 | RN1.6 RN1.5 0.85,53.13 0.51,53.46 0.51,55.51 SV2.4 | C2.1 29.77,61.69 28.68,62.78 27.01,62.78 26.29,63.5 | v27.08,67.32 27.08,65.82 F1.2 | R1.1 v11.52,15.26 | v32.64,71.12 33.06,70.7 33.08,70.7 33.75,70.03 33.75,69.48 R3.1 33.98,68.43 35.03,67.38 36.24,67.38 C15.1 36.75,67.85 36.75,68.37 37.42,69.04 IC5.20 | R9.1 v103,13.5 v103,13.49
  Top 0.305: 26.29,63.5 26.29,64.51 F1.2 | 37.92,62.99 IC5.1
  Top 0.406: C5.1 72.01,77.06 C4.2 CN2.20 | IC3.20 5.55,69.04 C14.1 | IC4.20 15.08,68.41 C17.1 | RN1.6 RN1.7 RN1.8
  Top 0.61: IC7.3 107.98,64.51 C20.1 107.81,64.83 107.81,67.37 107.79,67.36 106.11,67.36 v106.09,67.34 v104.34,67.34
  Top 1.016: C31.1 122.3,17.08 121.83,16.61 121.83,11.78 v121.86,11.75
  Top 1.27: v121.86,11.75 121.92,11.68 CN1.5
  Bottom 1.27: CN1.5 121.92,11.68 v121.86,11.75
  other vias: 107.81,67.36
  pour Route15-VCC (isolate 0.254, rank 2): -0.38,89.53 129.79,89.53 129.79,-0.64 -0.38,-0.64
A1  (via drill 0.3)
  Top 0.254: IC8.12 14.99,43.93 13.61,45.31 4.43,45.31 3.78,44.66 3.78,37.48 v3.03,36.73 | IC2.57 35.28,32.99 35.28,32.97 33.8,31.49 v32.29,31.49 v32.29,31.5 3.49,31.5 v3.43,31.43 3.49,31.49 | v90.28,19.09 89.98,18.8 33.43,18.8 33.29,18.94 32.25,18.94 v32.14,18.82
  Bottom 0.254: v3.03,36.73 3.03,31.84 v3.43,31.43 | CN1.29 91.44,17.93 v90.28,19.09 | v32.29,31.49 v32.29,31.5 32.27,31.48 32.13,31.34 | 32.13,31.34 v32.13,18.83 v32.14,18.82 | 32.29,31.53 32.13,31.37 32.13,31.34
A2  (via drill 0.3)
  Top 0.254: IC8.11 21.25,43.93 v21.28,43.97 | IC2.54 v32.92,32.76 v22.92,32.76 v22.91,32.77 | v32.97,18.27 92.22,18.27 v93.18,17.31
  Bottom 0.254: 21.37,43.97 v21.28,43.97 22.91,42.34 v22.91,32.77 | v93.18,17.31 93.18,11.4 93.97,10.61 CN1.27 | v32.92,32.76 32.92,18.32 v32.97,18.27
A3  (via drill 0.3)
  Top 0.254: v49.27,38.36 48.5,39.13 37.89,39.13 IC2.52 33.94,35.13 32.83,34.02 32.49,34.02 32.27,33.8 26.29,33.8 26.28,33.81 23.76,33.81 23.71,33.86 21.81,33.86 21.76,33.81 v21.56,33.81 v21.55,33.82 | CN1.26 96.5,5.1 96.5,9.46 97.45,10.41 97.45,21 96.62,21.84 v87.42,21.84 | v58.16,31.75 v71.91,31.75 v71.92,31.76
  Bottom 0.254: v49.27,38.36 49.3,38.36 49.72,37.94 53.22,37.94 54.87,36.29 54.88,36.29 55.38,35.79 55.38,35.24 55.79,34.83 55.97,34.83 56.22,34.58 56.22,32.81 57.29,31.74 v58.15,31.74 v58.16,31.75 | v87.42,21.84 87.42,26.88 86.36,27.94 76.98,27.94 76.98,28.02 73.23,31.76 v71.92,31.76 | IC8.10 16.17,41.39 17.33,40.23 21.41,40.23 21.75,39.89 21.75,34.02 v21.55,33.82
A4  (via drill 0.3)
  Top 0.254: v50.03,40 49.82,40.21 37.54,40.21 IC2.50 32.49,35.16 | v58.13,33.64 67.94,33.64 v67.98,33.69 | CN1.24 98.67,5.47 99.09,5.89 v99.09,20.91 | 32.49,35.16 | 32.49,35.16 32.42,35.09 31.65,35.09 31.51,34.95 31.23,34.95 30.99,34.71 29.19,34.71 29.19,34.72 24.2,34.72 23.63,35.29 v23.63,39.18 | IC8.9 18.61,41.46 v23.62,41.46
  Bottom 0.254: v50.03,40 50.21,40 50.86,39.35 53.77,39.35 55.53,37.59 57.15,37.59 57.4,37.33 57.4,33.97 57.73,33.64 v58.13,33.64 | v67.98,33.69 67.98,33.72 68.79,34.52 94.53,34.52 96.76,32.3 96.76,22.73 98.58,20.91 v99.09,20.91 | v23.63,39.18 23.62,39.19 v23.62,41.46
A5  (via drill 0.3)
  Top 0.254: v67.86,22.56 100.65,22.56 v101.57,21.64 | v50.36,40.86 50.18,40.67 37.33,40.67 32.9,36.25 IC2.49 32.2,35.57 31.42,35.57 31.24,35.39 30.94,35.39 30.71,35.17 29.39,35.17 29.37,35.15 24.55,35.15 24.36,35.34 24.36,39.38 23.65,40.1 16.95,40.1 15.98,39.13 IC8.8 | v58.18,34.82 64.05,34.82 64.21,34.66 65.97,34.66 66.08,34.54 67.05,34.54 v67.06,34.55 | v58.18,34.82
  Bottom 0.254: v67.86,22.56 67.85,22.57 67.85,27.27 67.04,28.08 67.04,34.53 v67.06,34.55 | v101.57,21.64 101.57,5.11 CN1.21 | v50.36,40.86 50.42,40.86 51.31,39.96 53.88,39.96 55.69,38.15 58.09,38.15 58.26,37.98 58.26,34.89 v58.18,34.82
A6  (via drill 0.3)
  Top 0.254: v49.97,39.05 49.35,39.67 37.72,39.67 IC2.51 33.59,35.53 32.62,34.57 32.23,34.57 31.94,34.28 28.93,34.28 28.92,34.28 24,34.28 19.42,38.85 IC8.7 | v58.14,32.66 68.37,32.66 v69.03,33.32
  Bottom 0.254: v49.97,39.05 50.39,38.62 53.51,38.62 55.24,36.9 56.66,36.9 56.81,36.74 56.81,33.72 56.81,33.19 57.33,32.66 v58.14,32.66 | v69.03,33.32 69.03,33.43 69.52,33.92 78.99,33.92 79.07,34.01 93.84,34.01 96.05,31.81 96.05,22.58 99.06,19.57 CN1.23
A7  (via drill 0.3)
  Top 0.254: v49.25,37.34 48.04,38.56 38.03,38.56 IC2.53 34.3,34.8 32.99,33.49 32.67,33.49 32.49,33.31 23.32,33.31 23.21,33.42 22.52,33.42 22.18,33.08 22.18,32.9 22.05,32.76 17.79,32.76 v17.77,32.75 | v87.41,20.53 91.21,20.53 93.97,17.77 CN1.28 | v72.5,30.8 72.15,30.8 71.87,31.08 58.47,31.08 v58.19,30.8
  Bottom 0.254: v49.25,37.34 52.92,37.34 54.72,35.55 54.72,34.86 55.65,33.92 55.65,32.43 57.29,30.8 v58.19,30.8 | v87.41,20.53 86.75,21.19 86.76,21.19 86.76,26.24 85.66,27.34 76.85,27.34 73.44,30.75 73.42,30.75 73.39,30.78 72.5,30.78 v72.5,30.8 | v17.77,32.75 17.77,34.7 17.25,35.23 | 17.25,35.23 | 17.25,35.23 16.76,35.72 16.58,35.72 IC8.6
A8  (via drill 0.3)
  Top 0.254: IC2.56 35.36,33.75 34.1,32.5 33.84,32.5 v33.61,32.27 33.59,32.27 33.39,32.07 32.67,32.07 32.61,32.13 32.57,32.13 32.48,32.22 23.3,32.22 23.2,32.12 23.12,32.12 23.07,32.07 18.61,32.07 | CN1.30 91.3,5.22 91.3,16.63 90.35,17.58 v33.61,17.58 | 18.57,32.11 v18.56,32.12 | 18.61,32.07 v18.56,32.12 | 18.61,32.07 v18.56,32.12
  Bottom 0.254: v33.61,17.58 v33.61,32.27 | v18.56,32.12 18.56,36.27 IC8.5
A9  (via drill 0.3)
  Top 0.254: v5.2,30.81 33.8,30.81 IC2.58 36.1,33.07 37.05,34.02 37.05,35.05 37.93,35.93 37.93,37.4 38.6,38.07 47.4,38.07 v48.19,37.28 | v58.13,29.03 59.06,29.03 59.31,29.28 70.35,29.28 70.51,29.13 71.1,29.13 71.33,29.36 72.4,29.36 v72.54,29.49 | v88.85,16.23 88.85,5.13 CN1.32
  Bottom 0.254: IC8.27 5.82,38.81 4.68,37.67 4.68,34.17 5.2,33.65 v5.2,30.81 | v48.19,37.28 | v48.19,37.28 48.86,36.62 52.59,36.62 54.03,35.18 54.03,34.58 55.17,33.45 55.17,32.02 58.16,29.03 v58.13,29.03 | v88.85,16.23 88.92,16.29 88.92,17.38 86.06,20.23 86.06,25.67 85.01,26.72 74.57,26.72 72.63,28.65 72.63,29.4 v72.54,29.49
A10  (via drill 0.3)
  Top 0.254: v7.08,30.16 33.86,30.16 IC2.59 37.58,33.88 37.58,34.91 38.45,35.77 38.45,37.2 38.89,37.63 46.8,37.63 v48.14,36.29 | v58.2,21.55 58.48,21.27 60.17,21.27 60.21,21.32 60.27,21.32 60.46,21.51 66.41,21.51 66.67,21.26 67.49,21.26 68.24,22.01 84.53,22.01 84.8,21.75 84.8,21.7 v85.22,21.28 | v86.34,12.48 86.36,12.45 CN1.34
  Bottom 0.254: IC8.26 8.3,41.39 7.08,40.18 v7.08,30.16 | v48.14,36.29 48.6,35.84 51.65,35.84 54.63,32.86 54.63,31.44 57.2,28.87 57.2,26.88 58.2,25.88 v58.2,21.55 | v86.34,12.48 86.22,12.48 85.22,13.48 v85.22,21.28
A11  (via drill 0.3)
  Top 0.254: v22.18,29.49 33.9,29.49 IC2.60 36.78,32.36 38.1,33.69 38.1,34.73 38.96,35.59 38.96,36.82 39.33,37.19 46.27,37.19 v47.01,36.45 | v57.59,20.93 57.72,20.81 60.46,20.81 60.7,21.05 66.08,21.05 66.33,20.8 68.01,20.8 68.72,21.51 83.18,21.51 v83.46,21.24 v83.46,21.23 | v83.81,12.47 v83.82,12.46 CN1.36
  Bottom 0.254: IC8.23 5.82,43.95 6.96,45.09 16.57,45.09 17.29,44.37 17.29,43.25 17.93,42.61 22,42.61 22.37,42.24 22.37,33.25 22.18,33.06 v22.18,29.49 | v47.01,36.45 48.4,35.06 48.42,35.06 48.51,35.15 51.62,35.15 54.1,32.67 54.1,31.21 56.67,28.64 56.67,26.55 57.59,25.63 v57.59,20.93 | v83.46,21.23 84.59,20.1 84.59,13.24 v83.81,12.47
A12  (via drill 0.3)
  Top 0.254: v4.29,29.58 4.43,29.44 21.22,29.44 21.79,28.86 22.51,28.86 22.56,28.92 34.04,28.92 IC2.61 37.12,32.05 38.61,33.53 38.61,34.5 39.44,35.34 39.44,36.36 39.77,36.69 40.12,36.69 40.13,36.7 45.7,36.7 v47.12,35.27 v47.13,35.27 | v56.99,20.32 57.22,20.09 77.76,20.09 78.27,20.61 79.07,20.61 79.61,20.06 v79.61,19.95 | v79.61,12.5 v79.63,12.49 79.63,9.76 81.28,8.1 CN1.38
  Bottom 0.254: IC8.25 4.18,39.75 4.18,33.84 4.49,33.53 4.49,29.78 v4.29,29.58 | v47.13,35.27 47.86,34.54 51.32,34.54 53.52,32.34 53.52,31.06 56.08,28.5 56.08,26.34 56.99,25.43 v56.99,20.32 | v79.61,19.95 v79.61,19.94 v79.61,12.5
A13  (via drill 0.3)
  Top 0.254: v15.98,28.19 20.63,28.19 20.97,27.85 34.51,27.85 36.59,29.93 37.16,29.93 38.17,30.95 IC2.64 39.09,31.86 39.09,32.43 39.76,33.1 39.76,33.69 39.95,33.88 39.95,35.98 40.16,36.19 40.84,36.19 40.84,36.2 45.12,36.2 v46.11,35.21 | v46.11,35.21 | v56.38,19.73 56.59,19.52 58.33,19.52 58.34,19.53 78.11,19.53 78.48,19.9 v78.62,19.9
  Bottom 0.254: v15.98,28.19 IC8.4 | IC8.4 | v46.11,35.21 47.47,33.85 50.9,33.85 52.89,31.87 52.89,30.79 55.46,28.22 55.46,26.22 56.38,25.29 v56.38,19.73 | v78.62,19.9 78.74,19.78 CN1.39
A14  (via drill 0.3)
  Top 0.254: IC2.66 37.31,28.66 v37.06,28.66 36.78,28.66 34.97,26.86 20.38,26.86 20.14,27.09 15.36,27.09 14.72,27.73 10.97,27.73 | 10.97,27.73 10.96,27.74 | 10.97,27.73 9.78,27.73 v9.68,27.64 | v76.24,16.91 37.33,16.91 v37.3,16.88
  Bottom 0.254: IC8.28 8.43,38.85 9.68,37.59 v9.68,27.64 | CN1.41 76.24,5.12 v76.24,16.91 | v37.3,16.88 37.06,17.12 v37.06,28.66
A15  (via drill 0.3)
  Top 0.254: IC2.74 45.21,27.45 v45.21,26.56 | v45.07,14.01 45.14,13.94 v73.53,13.94 | 5.79,24.65 v5.75,24.61 6.08,24.94 13.81,24.94 13.99,25.11 18.38,25.11 18.69,24.81 19.88,24.81 19.96,24.89 36.04,24.89 36.81,25.67 38.39,25.67 39.4,24.65 39.79,24.26 39.79,23.95 40.72,23.02 44.87,23.02 v45.2,23.35
  Bottom 0.254: CN1.43 | 73.53,5.21 CN1.43 | IC8.29 5.82,31.15 5.85,31.13 5.85,31.04 6.07,30.81 6.07,30.7 5.75,30.39 5.75,25.37 5.75,25.36 v5.75,24.61 | v45.07,14.01 45.09,14.03 45.09,23.24 v45.2,23.35 v45.21,23.36 v45.21,26.56 | v73.53,13.94 73.66,13.81 CN1.43
A16  (via drill 0.3)
  Top 0.254: IC2.97 56.75,32.19 56.75,30.41 57.46,29.7 58.96,29.7 59.28,30.03 70.58,30.03 v70.78,29.83
  Bottom 0.254: v70.78,29.83 70.78,9.42 71.12,9.08 CN1.45
A17  (via drill 0.3)
  Top 0.254: IC2.95 55.8,31.72 55.8,30.01 57.02,28.79 57.02,28.3 57.47,27.85 57.68,27.85 57.75,27.79 57.75,27.42 57.77,27.39 57.77,27.23 58.48,26.52 v58.87,26.52 | v58.79,22.41 58.82,22.39 58.82,22.07 59.17,21.72 60.02,21.72 60.25,21.96 60.3,21.96 60.33,21.94 v67.1,21.94
  Bottom 0.254: v58.87,26.52 59,26.39 59,22.81 58.79,22.6 v58.79,22.41 | v67.1,21.94 68.58,20.46 CN1.47
A18  (via drill 0.3)
  Top 0.254: IC2.94 55.23,31.58 55.23,29.71 55.71,29.23 55.71,25 v55.68,24.97 | v60.25,13.32 60.3,13.37 62.26,13.37 63.5,12.13 CN1.52
  Bottom 0.254: v55.68,24.97 55.71,24.95 55.71,19.29 56.15,18.85 59.2,18.85 60.25,17.8 v60.25,13.32
A19  (via drill 0.3)
  Top 0.254: IC2.92 54.21,31.19 54.21,29.2 54.66,28.76 54.66,26.42 v54.29,26.05 54.26,26.05 | v60.27,11.33 60.27,11.23 60.95,10.55 CN1.54
  Bottom 0.254: v54.29,26.05 54.26,26.02 54.26,24.55 54.57,24.23 54.57,18.77 55.59,17.75 58.52,17.75 58.98,17.29 58.98,12.34 59.98,11.33 v60.27,11.33
A20  (via drill 0.3)
  Top 0.254: IC2.91 53.62,31.07 53.62,28.85 54.01,28.46 54.01,26.73 53.86,26.57 v53.65,26.57 | CN1.56 58.42,12.93 v58.13,13.22
  Bottom 0.254: v58.13,13.22 58.13,16.84 57.79,17.18 55.44,17.18 54.04,18.58 54.04,23.92 53.64,24.32 53.64,26.57 v53.65,26.57
A21  (via drill 0.3)
  Top 0.254: IC2.88 50.39,32.18 51.64,32.18 53.08,30.74 53.08,27.03 52.95,26.91 v52.95,26.18 | CN1.58 | v55.87,13.22 CN1.58
  Bottom 0.254: v52.95,26.18 52.95,24.23 53.48,23.7 53.48,18.32 55.2,16.61 55.2,13.82 55.27,13.82 v55.87,13.22
A22  (via drill 0.3)
  Top 0.254: IC2.87 50.2,31.66 51.38,31.66 52.42,30.62 52.42,26.71 52.27,26.55 v52.27,25.52
  Bottom 0.254: v52.27,25.52 52.27,24 52.92,23.35 52.92,18 54.6,16.32 54.6,11.89 55.88,10.61 CN1.57
A23  (via drill 0.3)
  Top 0.254: IC2.86 50,31.16 51.13,31.16 51.78,30.51 51.78,26.79 51.52,26.53 v51.52,24.96
  Bottom 0.254: v51.52,24.96 51.52,23.88 52.38,23.02 52.38,17.7 54.12,15.96 54.12,5.86 CN1.59
AUTO_BOOT_OFF  (via drill 0.3)
  Top 0.254: IDE_OFF.2 3.26,20.27 R5.2 6.75,18.69 6.75,15.81 | IC2.75 44.55,28.9 43.92,29.53 43.92,29.55 42.55,30.92 40.8,30.92 v40.74,30.99 | 19.34,22.2 v19.34,22.19 | v19.34,22.19 20.12,22.19 20.67,22.74 21.26,22.74 21.7,23.18 37.01,23.18 37.32,23.5 38.43,23.5 38.67,23.26 v39.12,23.26 | 6.75,15.81 | v19.34,22.19 19.34,15.77 18.08,14.51 8.05,14.51 6.75,15.81
  Bottom 0.254: v40.74,30.99 39.73,29.98 39.73,23.28 39.14,23.28 v39.12,23.26
C1  (via drill 0.3)
  Top 0.254: CN1.14 111.76,10.41 110.83,11.35 v110.83,14.56 | IC2.103 55.41,37.77 58.17,37.77 58.58,37.36 v64.49,37.36 v64.49,37.37 | 64.56,27.35 64.49,27.28 v64.49,27.18 64.66,27.35 105.17,27.35 110.83,21.69 v110.83,21.54
  Bottom 0.254: 64.5,37.36 v64.49,37.37 64.34,37.22 64.34,27.41 64.42,27.33 64.42,27.28 64.49,27.21 v64.49,27.18 | v110.83,21.54 v110.83,14.57 v110.83,14.56
C3  (via drill 0.3)
  Top 0.254: IC2.102 55.17,37.31 57.77,37.31 58.38,36.69 64.97,36.69 v65.04,36.62 | v109.2,13.63 109.2,5.1 CN1.16 | v109.18,22.31 v109.18,22.32 104.81,26.69 65.51,26.69 v65.49,26.66
  Bottom 0.254: v65.04,36.62 65.04,27.56 65.16,27.44 65.16,26.98 v65.49,26.66 | v109.2,13.63 109.17,13.66 v109.17,22.3 v109.18,22.31
C_IDE_A0  (via drill 0.3)
  Top 0.254: IC2.24 32.86,47.57 31.56,48.86 31.56,51.82 v32.07,52.33 | IC5.7 41.87,62.35 38.61,59.09 38.61,59.08 38.56,59.04 36.28,59.04 36.2,58.96 36.2,56.49 36.48,56.21 36.48,55.02 35.44,53.97 34.31,53.97 v34.14,53.81
  Bottom 0.254: v32.07,52.33 32.07,53.4 32.47,53.81 v34.14,53.81
C_IDE_A1  (via drill 0.3)
  Top 0.254: IC2.26 32.17,46.89 31.44,47.63 30.06,49.01 v30.06,54.23 | v35.29,55.65 35.29,59.56 35.59,59.87 38.13,59.87 40.57,62.3 IC5.5
  Bottom 0.254: v30.06,54.23 31.66,55.82 33.94,55.82 34.11,55.65 v35.29,55.65
C_IDE_A2  (via drill 0.3)
  Top 0.254: IC2.25 32.53,47.24 31.93,47.83 31.91,47.83 31.06,48.68 v31.06,53.22 v31.06,53.23 | v34.88,54.78 34.88,54.71 35.52,54.71 36.06,55.26 36.06,55.99 35.78,56.27 35.78,59.3 35.94,59.46 38.35,59.46 41.22,62.33 IC5.6
  Bottom 0.254: v31.06,53.22 v31.06,53.23 32.61,54.78 v34.88,54.78
C_IDE_CS0  (via drill 0.3)
  Top 0.254: IC5.9 43.19,63.02 43.19,62.43 41.12,60.36 v41.12,60.04 | IC2.22 32.76,49.09 32.76,50.88 33.53,51.65 33.53,53.5 33.49,53.54 33.49,58.14 33.61,58.26 33.63,58.26 33.71,58.34 33.71,59.77 v33.94,60
  Bottom 0.254: 33.98,60.05 v33.94,60 33.98,60.04 v41.12,60.04
C_IDE_CS1  (via drill 0.3)
  Top 0.254: IC2.23 33.22,47.92 32.16,48.98 32.16,51.04 33.06,51.94 33.06,53.25 33.01,53.3 v33.01,58.66 | IC5.8 42.52,62.41 39.38,59.28 v39.38,58.92
  Bottom 0.254: 33.04,58.68 v33.01,58.66 | 33.06,58.7 v33.01,58.66 | 33.02,58.67 v33.01,58.66 | v39.38,58.92 34.46,58.92 34.2,58.66 v33.02,58.66 v33.01,58.66
C_IDE_R  (via drill 0.3)
  Top 0.254: IC3.1 6.85,64.51 v7.73,65.38 | v16.97,65.02 16.97,62.45 IC4.1 17.03,62.39 17.03,58.62 17.49,58.16 23.08,58.16 24.21,57.03 v24.44,57.03 | IC2.27 30.82,47.5 30.82,47.51 29.08,49.25 29.08,52.09 v28.92,52.25 | IC5.4 39.89,63.01 39.89,62.33 37.86,60.3 35.27,60.3 34.55,59.59 v34.55,56.32
  Bottom 0.254: v7.73,65.38 16.62,65.38 v16.97,65.02 | v34.55,56.32 30.28,56.32 30.25,56.35 29.4,55.51 29.39,55.51 28.88,54.99 28.88,52.3 v28.92,52.25 26.4,52.25 26.02,52.63 25.04,52.63 24.42,53.26 24.42,55.51 | 24.42,55.51 24.42,57.01 v24.44,57.03 | 24.42,55.51
C_IDE_W
  Top 0.254: IC2.28 31.45,46.15 30.2,47.41 30.2,47.43 28.79,48.83 | 28.79,48.83 | 28.79,48.83 28.08,49.55 28.08,54.22 29.47,55.61 29.47,55.62 31.22,57.36 31.22,59.34 31.96,60.09 32.48,60.09 33.14,60.75 37.66,60.75 39.27,62.36 IC5.3
CLK_EXT  (via drill 0.3)
  Top 0.254: 30.77,45.45 IC2.30 27.12,49.08 27.12,52.63 25.98,53.77 25.98,56.09 26.3,56.42 26.3,57.38 26.59,57.66 28.85,57.66 28.85,57.68 29.16,57.99 29.17,57.99 29.22,58.04 | IC1.33 88.46,50.62 90.66,52.81 90.66,58.63 91.75,59.73 91.75,64.25 90.98,65.03 73.61,65.03 73.08,65.56 73.08,66.14 73.04,66.18 73.03,66.18 72.07,67.15 71.36,67.86 45.49,67.86 v45.49,67.87 | v27.69,61.7 v28.27,61.11 28.27,59.88 29.26,58.88 29.26,58.08 29.22,58.04 | 29.22,58.04
  Bottom 0.254: v28.27,61.11 31.59,61.11 32.83,62.35 36.94,62.35 37.96,63.37 37.96,65.26 39.58,66.88 44.5,66.88 v45.49,67.87
CP_CS  (via drill 0.3)
  Top 0.254: IC2.34 29.32,44.03 29.32,44.04 25.27,48.1 25.27,48.97 25.26,48.97 25.26,53.12 25.05,53.34 25.05,56.77 25.18,56.9 25.18,57.9 25.34,58.05 25.34,58.89 v24.68,59.55
  Bottom 0.254: v24.68,59.55 24.68,67.72 25.65,68.69 34.47,68.69 39.01,73.24 39.01,77.23 39.94,78.16 75.75,78.16 CN2.22
CP_IRQ  (via drill 0.3)
  Top 0.254: CN2.21 76.71,75.17 74.67,73.13 74.67,71.94 R11.2 | IC2.31 30.39,45.09 27.59,47.9 26.55,48.94 26.55,51.45 26.62,51.52 26.62,52.07 26.18,52.51 26.18,52.9 25.54,53.54 25.54,56.45 25.71,56.62 25.71,57.83 25.89,58.01 v25.89,60.06
  Bottom 0.254: CN2.21 73.36,71.85 65.92,71.85 64.54,70.47 47.79,70.47 46.29,68.96 45.07,68.96 43.43,67.32 39.29,67.32 37.52,65.55 37.52,63.6 36.83,62.92 27.37,62.92 26.49,62.04 | 25.92,60.09 v25.89,60.06 | 25.91,60.08 v25.89,60.06 | 26.49,62.04 | 26.49,62.04 25.9,61.45 v25.9,60.06 v25.89,60.06
CP_RD  (via drill 0.3)
  Top 0.254: v81.58,56.95 81.22,56.95 80.93,57.24 73.83,57.24 73.52,56.94 70.72,56.94 70.31,57.36 69.91,57.36 68.23,59.03 68.23,59.5 67.51,60.21 62.84,60.21 62.68,60.05 v62.46,60.05 | IC2.71 40.66,28.45 40.65,28.45 39.3,27.1 39.3,26.17 41.41,24.06 44.33,24.06 45.18,24.91 48.93,24.91 48.94,24.89 48.98,24.89 49.61,24.26 58.83,24.26 59.01,24.45 59.01,24.62 59.75,25.36 v61.63,25.36 61.54,25.27
  Bottom 0.254: CN2.25 80.71,74.17 84.4,70.48 84.4,64.62 81.58,61.79 v81.58,56.95 v81.58,56.94 | v62.46,60.05 62.25,60.05 61.44,59.24 61.45,59.23 61.45,25.62 61.63,25.43 v61.63,25.36
CP_WE  (via drill 0.3)
  Top 0.254: v79.02,56.58 78.6,56.58 78.4,56.77 74.09,56.77 73.76,56.45 70.46,56.45 70.08,56.83 70.06,56.85 69.61,56.85 67.68,58.78 67.68,59.31 67.29,59.7 63.49,59.7 v63.35,59.56 | IC2.70 38.8,27.33 38.8,26.05 39.72,25.13 39.72,25.12 40.29,24.55 40.32,24.55 41.28,23.59 44.53,23.59 45.34,24.4 48.74,24.4 49.32,23.81 59.18,23.81 59.39,24.02 59.39,24.04 60.04,24.69 61.3,24.69 61.32,24.66 61.94,24.66 62.35,25.08 62.35,25.89 v62.12,26.12
  Bottom 0.254: CN2.26 80.67,77.2 79.76,76.29 79.76,73.88 83.59,70.05 83.59,64.94 80.52,61.87 80.52,58.08 v79.02,56.58 | v63.35,59.56 62.88,59.56 61.96,58.65 61.96,26.27 v62.12,26.12
D0  (via drill 0.3)
  Top 0.254: IC2.2 40.67,55.34 41.4,54.61 41.4,54.34 42.37,53.38 44.12,53.38 44.75,52.75 44.75,51.45 44.26,50.96 44.26,50.95 43.44,50.13 43.44,42.8 v43.21,42.57 | v43.21,14.03 v43.21,14.02 v35.07,14.02
  Bottom 0.254: CN1.75 | v43.21,42.57 v43.21,14.03 | 33.04,5.1 CN1.75 | v35.08,14.03 34.35,14.03 33.05,12.73 33.05,5.11 CN1.75 | v35.07,14.02 v35.08,14.03 | 35.08,14.03 v35.08,14.03
D1  (via drill 0.3)
  Top 0.254: IC2.17 35.36,50.02 37.49,47.9 37.49,42.19 v37.49,42.18 | v30.46,16.89 36.36,16.89 v36.37,16.89
  Bottom 0.254: v30.46,16.89 30.46,5.1 CN1.77 | v36.37,16.89 36.37,41.04 36.94,41.62 36.94,41.63 v37.49,42.18
D2  (via drill 0.3)
  Top 0.254: IC2.39 29.34,39.79 28.68,39.13 28.1,38.54 27.83,38.54 27.46,38.18 27.43,38.18 v27.15,37.9
  Bottom 0.254: CN1.79 27.94,36.62 27.02,37.54 27.02,37.77 v27.15,37.9
D3  (via drill 0.3)
  Top 0.254: IC2.15 41.35,45.46 41.35,42.55 41.34,42.54 v41.17,42.54 | v41.85,12.63 v25.46,12.63 v25.44,12.62
  Bottom 0.254: v41.17,42.54 41.17,42.07 41.9,41.33 41.9,12.69 v41.85,12.63 | 25.42,5.1 CN1.81 25.44,5.12 v25.44,12.62
D4  (via drill 0.3)
  Top 0.254: IC2.21 33.94,48.59 33.98,48.59 34.69,47.87 34.69,42.53 v34.37,42.21 | v32.75,14.77 v22.85,14.77 v22.84,14.78
  Bottom 0.254: v22.84,14.78 22.84,5.1 CN1.83 | v32.75,14.77 32.75,16.34 33.27,16.86 33.83,16.86 34.34,17.37 34.34,42.18 v34.37,42.21
D5  (via drill 0.3)
  Top 0.254: IC2.20 34.3,48.96 34.32,48.96 35.46,47.82 v35.46,42.19 | CN1.86 20.32,10.2 21.52,11.39 21.52,14.45 22.56,15.5 v34.87,15.5
  Bottom 0.254: v35.46,42.19 35.46,41.9 34.97,41.4 34.97,15.59 v34.87,15.5
D6  (via drill 0.3)
  Top 0.254: IC2.14 36.45,51.1 42.14,45.4 v42.14,42.54 | CN1.84 22.81,5.13 22.81,12.8 23.32,13.31 v42.49,13.31
  Bottom 0.254: v42.14,42.54 42.14,41.91 42.54,41.52 42.54,13.36 v42.49,13.31
D7  (via drill 0.3)
  Top 0.254: IC2.16 40.69,45.42 40.69,43.16 v40.1,42.56 | v41.1,11.94 26.02,11.94 25.43,11.35 25.43,5.11 CN1.82
  Bottom 0.254: v40.1,42.56 40.1,42.36 41.37,41.09 41.37,28.46 40.51,27.6 | 40.51,27.6 | 40.51,27.6 40.35,27.43 40.35,26.64 41.28,25.7 41.28,13.06 41.21,12.99 41.21,12.05 v41.1,11.94 41.17,12.02
D8  (via drill 0.3)
  Top 0.254: IC2.19 34.65,49.32 34.67,49.32 36.46,47.53 v36.46,42.19 v36.46,42.18 | v35.66,16.21 v26.87,16.21 | CN1.80 27.94,10.13 v26.86,11.21
  Bottom 0.254: v36.46,42.19 36.46,42.1 35.66,41.3 v35.66,16.21 | v26.87,16.21 v26.87,11.22 v26.86,11.21
D9  (via drill 0.3)
  Top 0.254: IC2.40 29.67,39.44 29.67,39.42 v28.12,37.87 | 29.2,9.73 v29.2,9.83 29.74,9.83 30.47,9.1 30.47,8.47 CN1.78
  Bottom 0.254: 28.6,10.43 v29.2,9.83 | 28.61,10.44 28.6,10.43 | 28.6,10.43 28.51,10.52 28.51,37.75 28.24,37.75 v28.12,37.87
D10  (via drill 0.3)
  Top 0.254: IC2.41 29.21,38.25 v29.21,37.69 | CN1.76 33.04,5.1 33.04,9.5 31.6,10.94 31.6,10.95 31.32,11.23 v29.57,11.23
  Bottom 0.254: v29.21,37.69 29.21,37.67 29.04,37.5 29.04,11.5 29.29,11.5 v29.57,11.23
D11  (via drill 0.3)
  Top 0.254: IC2.43 29.97,37.58 29.86,37.46 29.86,37.36 29.73,37.23 29.58,37.09 29.55,37.09 29.49,37.03 29.42,37.03 | 29.42,37.03 29.39,37 | v38.04,19.46 v27.19,19.46 v27.19,19.47 | 29.42,37.03 29.39,37.03 28.19,35.83 v27.27,35.83
  Bottom 0.254: CN1.71 38.04,5.14 v38.04,19.46 | v27.27,35.83 27.27,19.56 v27.19,19.47
D12  (via drill 0.3)
  Top 0.254: IC2.44 30.5,37.4 30.35,37.26 30.35,37.22 30.14,37.01 30.14,36.95 29.71,36.52 v29.71,36.32 | v29.71,14.02 33.87,14.02 34.62,14.77 v39.5,14.77 v39.51,14.76
  Bottom 0.254: v29.71,36.32 v29.71,14.02 | 40.65,5.09 CN1.69 | 40.66,5.09 CN1.69 | v39.51,14.76 39.51,10.11 40.64,8.98 CN1.69
D13  (via drill 0.3)
  Top 0.254: IC2.45 31.46,37.67 30.82,37.03 30.82,36.91 30.56,36.65 30.56,36.64 30.47,36.55 30.47,36.49 30.44,36.47 30.44,36.37 30.38,36.32 30.38,35.88 v30.41,35.85 | v30.41,20.17 v43.89,20.17 v43.9,20.18
  Bottom 0.254: v30.41,35.84 v30.41,35.85 30.28,35.72 30.28,20.3 v30.41,20.17 | CN1.67 43.17,9.62 43.9,10.36 v43.9,20.18
D14  (via drill 0.3)
  Top 0.254: IC2.46 31.13,36.62 v31.13,36.2 31.1,36.18 | v30.94,20.86 45.76,20.86 v45.78,20.88
  Bottom 0.254: v31.13,36.2 31.13,35.59 30.81,35.27 30.81,21 v30.94,20.86 | CN1.65 45.78,5.14 v45.78,20.88
D15  (via drill 0.3)
  Top 0.254: IC2.48 32.53,36.62 37.14,41.23 44.57,41.23 v44.73,41.4
  Bottom 0.254: v44.73,41.4 44.73,29.14 46.91,26.95 46.91,22.15 46.45,21.68 46.45,20.59 46.29,20.43 46.29,11.15 46.29,11.14 48.26,9.17 CN1.63
DOE  (via drill 0.3)
  Top 0.254: IC2.38 27.99,39.13 27.72,39.13 27.31,38.72 26.56,38.72 v26.45,38.61 | v25.92,16.22 22.59,16.22 21,14.64 21,13.43 20.46,12.89 12.07,12.89 v10.14,10.97
  Bottom 0.254: v26.45,38.61 26.45,16.75 v25.92,16.22 | v10.14,10.97 10.14,5.1 CN1.93
DQ0  (via drill 0.3)
  Top 0.254: IC3.3 v8.15,61.84 v8.16,61.83 | v49.59,45.85 52.38,45.85 52.47,45.94 IC2.118 53.81,47.27 54.3,47.27 54.55,47.52 54.55,47.54 72.7,47.54 72.76,47.48 72.87,47.48 73.06,47.29 73.06,47.28 73.13,47.2 73.9,47.2 73.94,47.24 | 78.51,46.19 78.54,46.22 78.44,46.22 78.42,46.2 | 78.42,46.2 IC1.53 | IC1.53 | CN2.38 92.71,76.92 91.75,75.96 91.75,74.88 | 74.12,47.06 74.16,47.06 74.68,46.54 75.03,46.54 v75.23,46.34 75.37,46.2 78.42,46.2 | 74.12,47.06 74.13,47.06 | v75.12,66.58 82.7,66.58 | 82.7,66.58 83.5,66.58 | 73.94,47.25 73.94,47.24 | 73.94,47.24 74.12,47.06 | 91.75,74.83 91.75,74.88 | 91.75,74.88 91.77,74.9 91.77,67.12 91.23,66.59 82.7,66.59 82.7,66.58 | v18.43,50.93 v8.31,50.93 v8.3,50.93
  Bottom 0.254: v8.16,61.83 8.16,51.08 v8.3,50.93 | v49.59,45.85 19.15,45.85 IC8.13 18.39,46.61 18.39,50.88 v18.43,50.93 | v75.23,46.34 75.23,66.48 v75.12,66.58
DQ1  (via drill 0.3)
  Top 0.254: 92.71,75.07 CN2.37 92.72,75.19 92.72,66.59 92.04,65.9 74.59,65.9 v74.58,65.89 | IC1.54 74.71,45.7 v74.55,45.87 74.37,45.87 74.37,45.96 73.71,46.62 73.04,46.62 72.95,46.7 72.93,46.7 72.77,46.87 | IC3.5 v9.45,61.85 | v9.45,51.89 v15.99,51.89 | v48.52,45 52.24,45 IC2.117 54.05,46.81 54.41,46.81 54.67,47.07 arc90 54.68,47.06 72.58,47.06 72.77,46.87 | 72.77,46.87
  Bottom 0.254: v74.55,45.87 74.58,45.9 v74.58,65.89 | v9.45,61.85 v9.45,51.9 v9.45,51.89 | v15.99,51.89 IC8.14 17.29,47.71 17.29,45.47 17.54,45.21 48.3,45.21 v48.52,45
DQ2  (via drill 0.3)
  Top 0.254: IC1.55 74.01,45.2 v73.92,45.3 | v74.36,68.03 88.96,68.03 89.66,68.72 89.66,74.11 89.66,76.15 CN2.36 | v73.92,48.67 73.75,48.5 53.62,48.5 IC2.120 51.49,46.38 50.15,46.38 50.13,46.4 49.95,46.59 49.16,46.59 48.89,46.32 47.61,46.32 v47.49,46.44 | IC3.7 v10.75,61.85 v10.75,61.84 | v10.74,52.89 14.67,52.89 v14.68,52.88 | IC8.15 16.97,46.47 17.31,46.81 17.31,47.52 17.5,47.71 19.79,47.71 v20.81,46.69
  Bottom 0.254: 74.34,68 v74.36,68.03 73.92,67.58 v73.92,48.67 v73.92,45.3 | v10.75,61.84 v10.75,52.9 v10.74,52.89 | v14.68,52.88 14.68,47.78 IC8.15 | v47.49,46.44 21.06,46.44 v20.81,46.69
DQ3  (via drill 0.3)
  Top 0.254: CN2.35 90.71,74.47 90.7,74.46 90.7,67.97 90.03,67.3 73.34,67.3 v73.24,67.19 | v73.33,44.8 73.53,44.8 73.61,44.71 79.1,44.71 IC1.56 | IC3.9 v12.05,61.85 v12.05,61.84 | 73.31,47.88 v73.33,47.87 73.19,48 54.07,48 v53.95,47.88 53.7,47.88 53.16,47.34 IC2.119 | 22.15,45.42 22.39,45.66 22.4,45.66 23.4,46.66 v23.4,47.64 v23.41,47.65 | 14.5,45.42 IC8.17 13.71,46.47 13.71,46.21 14.56,45.36 22.09,45.36 23.41,46.67 v23.41,47.65 | 23.4,47.65 23.41,47.65 v23.41,47.65
  Bottom 0.254: v73.24,67.19 73.24,47.95 v73.33,47.87 v73.33,44.8 | v12.05,61.84 12.05,47.86 IC8.17 | v23.4,47.64 v23.41,47.64 52.82,47.64 53.06,47.88 v53.95,47.88
DQ4  (via drill 0.3)
  Top 0.254: 52.05,49.76 IC2.124 50.89,48.63 49.96,47.7 46.75,47.7 v45.77,48.68 | 52.05,49.76 | 52.05,49.76 52.14,49.86 v67.95,49.86 v67.96,49.86 | IC1.5 v82.96,40.51 v82.95,40.52 | CN2.34 88.71,76.9 87.78,75.97 87.78,69.62 87.42,69.26 80.31,69.26 v80.23,69.34 | IC4.3 v18.31,60.79 | v18.31,60.79 | IC8.18 12.2,50.31 v17.19,50.31 v19.32,50.31
  Bottom 0.254: v82.95,40.52 82.95,40 81.86,38.91 68.84,38.91 67.96,39.79 v67.96,49.86 67.93,49.89 67.93,67.91 69.35,69.34 v80.23,69.34 | v18.31,60.79 18.31,52.58 17.18,51.45 17.18,50.32 v17.19,50.31 | v45.77,48.68 23.78,48.68 23.4,49.06 20.56,49.06 v19.32,50.31
DQ5  (via drill 0.3)
  Top 0.254: v66.98,49.19 66.96,49.17 53.58,49.17 51.98,47.57 IC2.121 52,47.57 53.61,49.17 53.78,49.17 v53.82,49.21 | v83.51,36.58 83.51,38.27 83.45,38.33 | 83.45,38.33 83.45,38.26 | CN2.33 88.71,73.86 88.71,69.57 87.8,68.66 67.12,68.66 v67.07,68.61 | IC4.5 v19.61,60.79 | v6.73,53.78 v19.61,53.78 v19.62,53.79 21.75,53.79 22.41,53.13 v22.41,48.32 | IC1.6 83.46,38.34 83.45,38.33
  Bottom 0.254: v83.51,36.58 82.73,35.8 67.73,35.8 66.98,36.55 v66.98,49.19 67.07,49.28 v67.07,68.61 | v19.61,60.79 v19.61,53.78 | v6.73,53.78 6.73,48.35 7.26,47.83 9.55,47.83 IC8.19 | v53.82,49.21 53.63,49.21 52.65,48.24 46.43,48.24 46.36,48.18 46.36,48.15 46.27,48.06 45.1,48.06 44.98,48.18 | 22.48,48.24 v22.41,48.32 | v22.41,48.32 22.55,48.18 22.66,48.18 22.87,48.39 | 44.97,48.16 44.98,48.18 | v22.41,48.32 22.48,48.39 23.42,48.39 23.63,48.18 44.98,48.18
DQ6  (via drill 0.3)
  Top 0.254: v65.01,51.52 65,51.51 52.39,51.51 IC2.126 49.68,48.81 49.67,48.81 49.1,48.24 47.3,48.24 46.74,48.8 v46.74,48.9 | IC1.7 83.96,40.51 v83.95,40.52 | v67.93,38.42 65.11,38.42 v65.02,38.52 | CN2.32 86.71,77.19 85.77,76.25 85.77,71.24 85.57,71.05 v80.23,71.05 v80.22,71.05 | IC4.7 20.91,60.79 v20.9,60.77 | v20.9,54.72 v7.48,54.72
  Bottom 0.254: v83.95,40.52 83.95,40.03 82.31,38.39 67.96,38.39 v67.93,38.42 | v65.02,38.52 65.02,51.51 v65.01,51.52 v65.02,51.52 65.02,69.73 66.36,71.07 80.21,71.07 v80.22,71.05 | v20.9,60.77 v20.9,54.72 | v20.9,54.72 | v7.48,54.72 7.48,49.89 IC8.20 | v20.9,54.72 20.9,50.07 21.34,49.63 23.55,49.63 24.07,49.11 45.24,49.11 45.44,49.31 46.1,49.31 46.16,49.24 46.16,49.23 46.23,49.16 46.47,49.16 v46.74,48.9
DQ7  (via drill 0.3)
  Top 0.254: v65.98,50.69 65.97,50.67 52.25,50.67 IC2.125 50.57,48.98 52.26,50.67 52.3,50.67 v52.46,50.51 | IC1.8 v84.46,36.59 v84.46,36.58 | CN2.31 86.71,70.57 86.19,70.05 v81.23,70.05 | v6.75,55.44 21.41,55.44 | v22.25,60.77 22.25,62.37 IC4.9 | 21.41,55.44 | v22.25,54.71 22.14,54.71 21.41,55.44
  Bottom 0.254: v84.46,36.58 84.46,35.86 83.81,35.22 67.53,35.22 66.29,36.46 66.29,49.42 65.95,49.76 65.95,50.66 v65.98,50.69 65.96,50.71 65.96,69.3 66.71,70.06 v81.23,70.06 v81.23,70.05 | IC8.21 5.82,54.51 v6.75,55.44 | v22.25,60.77 22.22,60.75 22.22,54.74 v22.25,54.71 22.25,50.53 22.22,50.5 22.63,50.09 23.77,50.09 24.28,49.58 45.02,49.58 45.15,49.71 46.91,49.71 47.87,48.75 50.33,48.75 52.09,50.51 v52.46,50.51
DQ8  (via drill 0.3)
  Top 0.254: IC4.8 21.56,64.45 22.37,65.25 22.96,65.25 23.85,64.36 23.85,62.3 23.85,61.43 24.12,61.16 26.55,61.16 27.15,60.56 27.15,59.06 v27.6,58.61 | IC1.35 87.46,51.51 89.36,53.41 89.36,60.6 88.62,61.34 88.62,63.63 88.3,63.95 73.18,63.95 72.16,64.97 72.16,65.69 72.17,65.7 | 72.17,65.7 | 72.17,65.7 70.87,67 58.77,67 58.01,66.24 57.49,66.24 57.26,66.47 57.26,66.51 57.18,66.6 57.18,66.65 57.1,66.73 57.1,67.19 56.95,67.33 53.26,67.33 v53.06,67.13 | 49.53,50.07 49.53,50.04 IC2.128 52.23,52.78 v53.15,52.78
  Bottom 0.254: v27.6,58.61 v27.59,58.6 27.59,57.99 28.33,57.99 28.44,57.88 32.02,57.88 32.4,57.5 39.75,57.5 40.57,58.32 42.56,58.32 43.15,58.91 46.94,58.91 46.97,58.94 46.99,58.94 | v53.15,52.78 53.15,67.03 v53.06,67.13 51.77,67.13 51.34,66.7 51.19,66.7 49.4,64.91 | 49.4,64.91 47.95,63.46 47.95,61.21 48.01,61.14 48.01,59.96 46.99,58.94 | 49.4,64.91 | 46.99,58.94
DQ9  (via drill 0.3)